# EAGLE design sa_dsp (EAGLE 9.6.2)
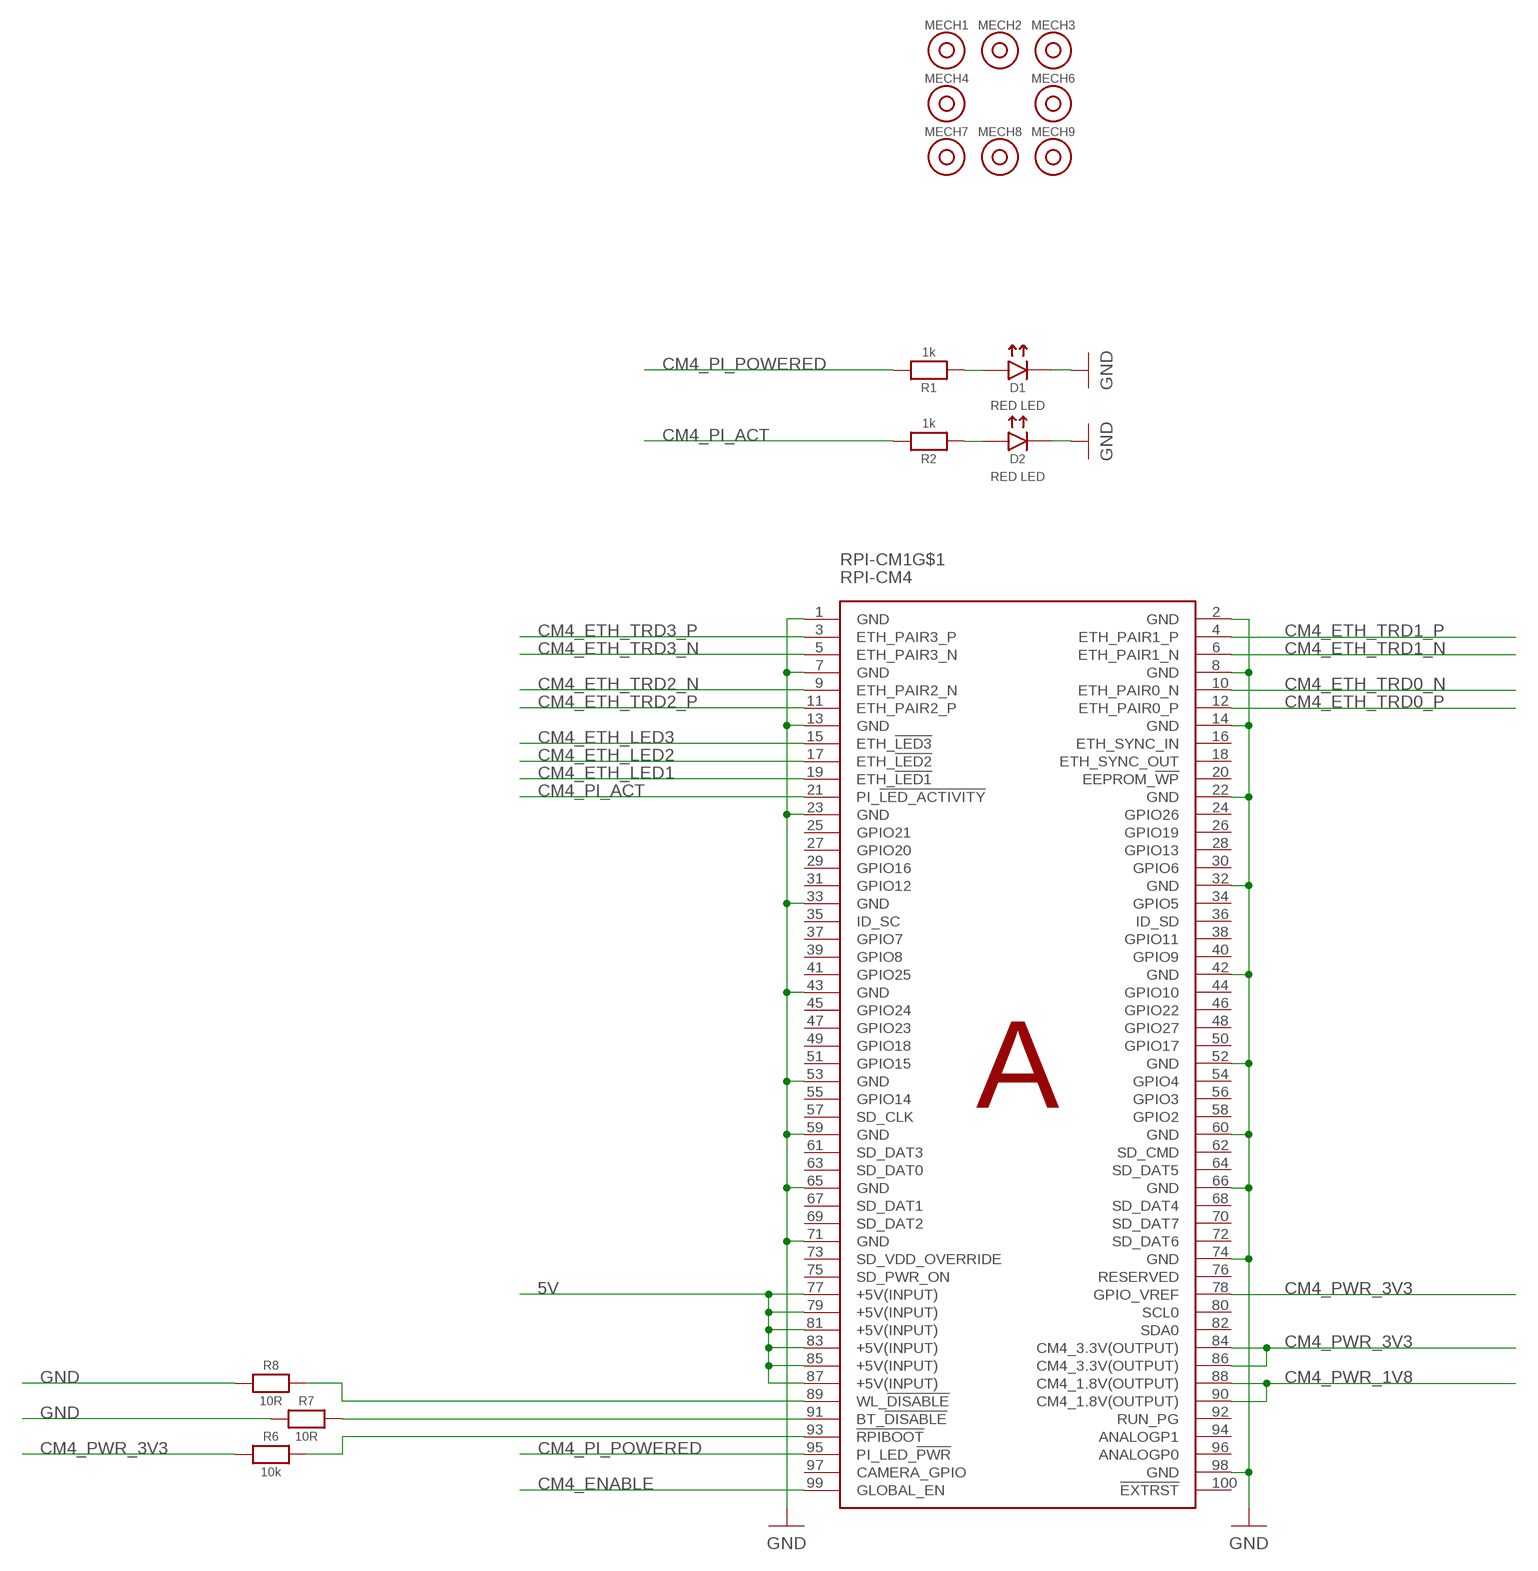
[diagram p0: schematic, sheet 1, part 1 of 2]
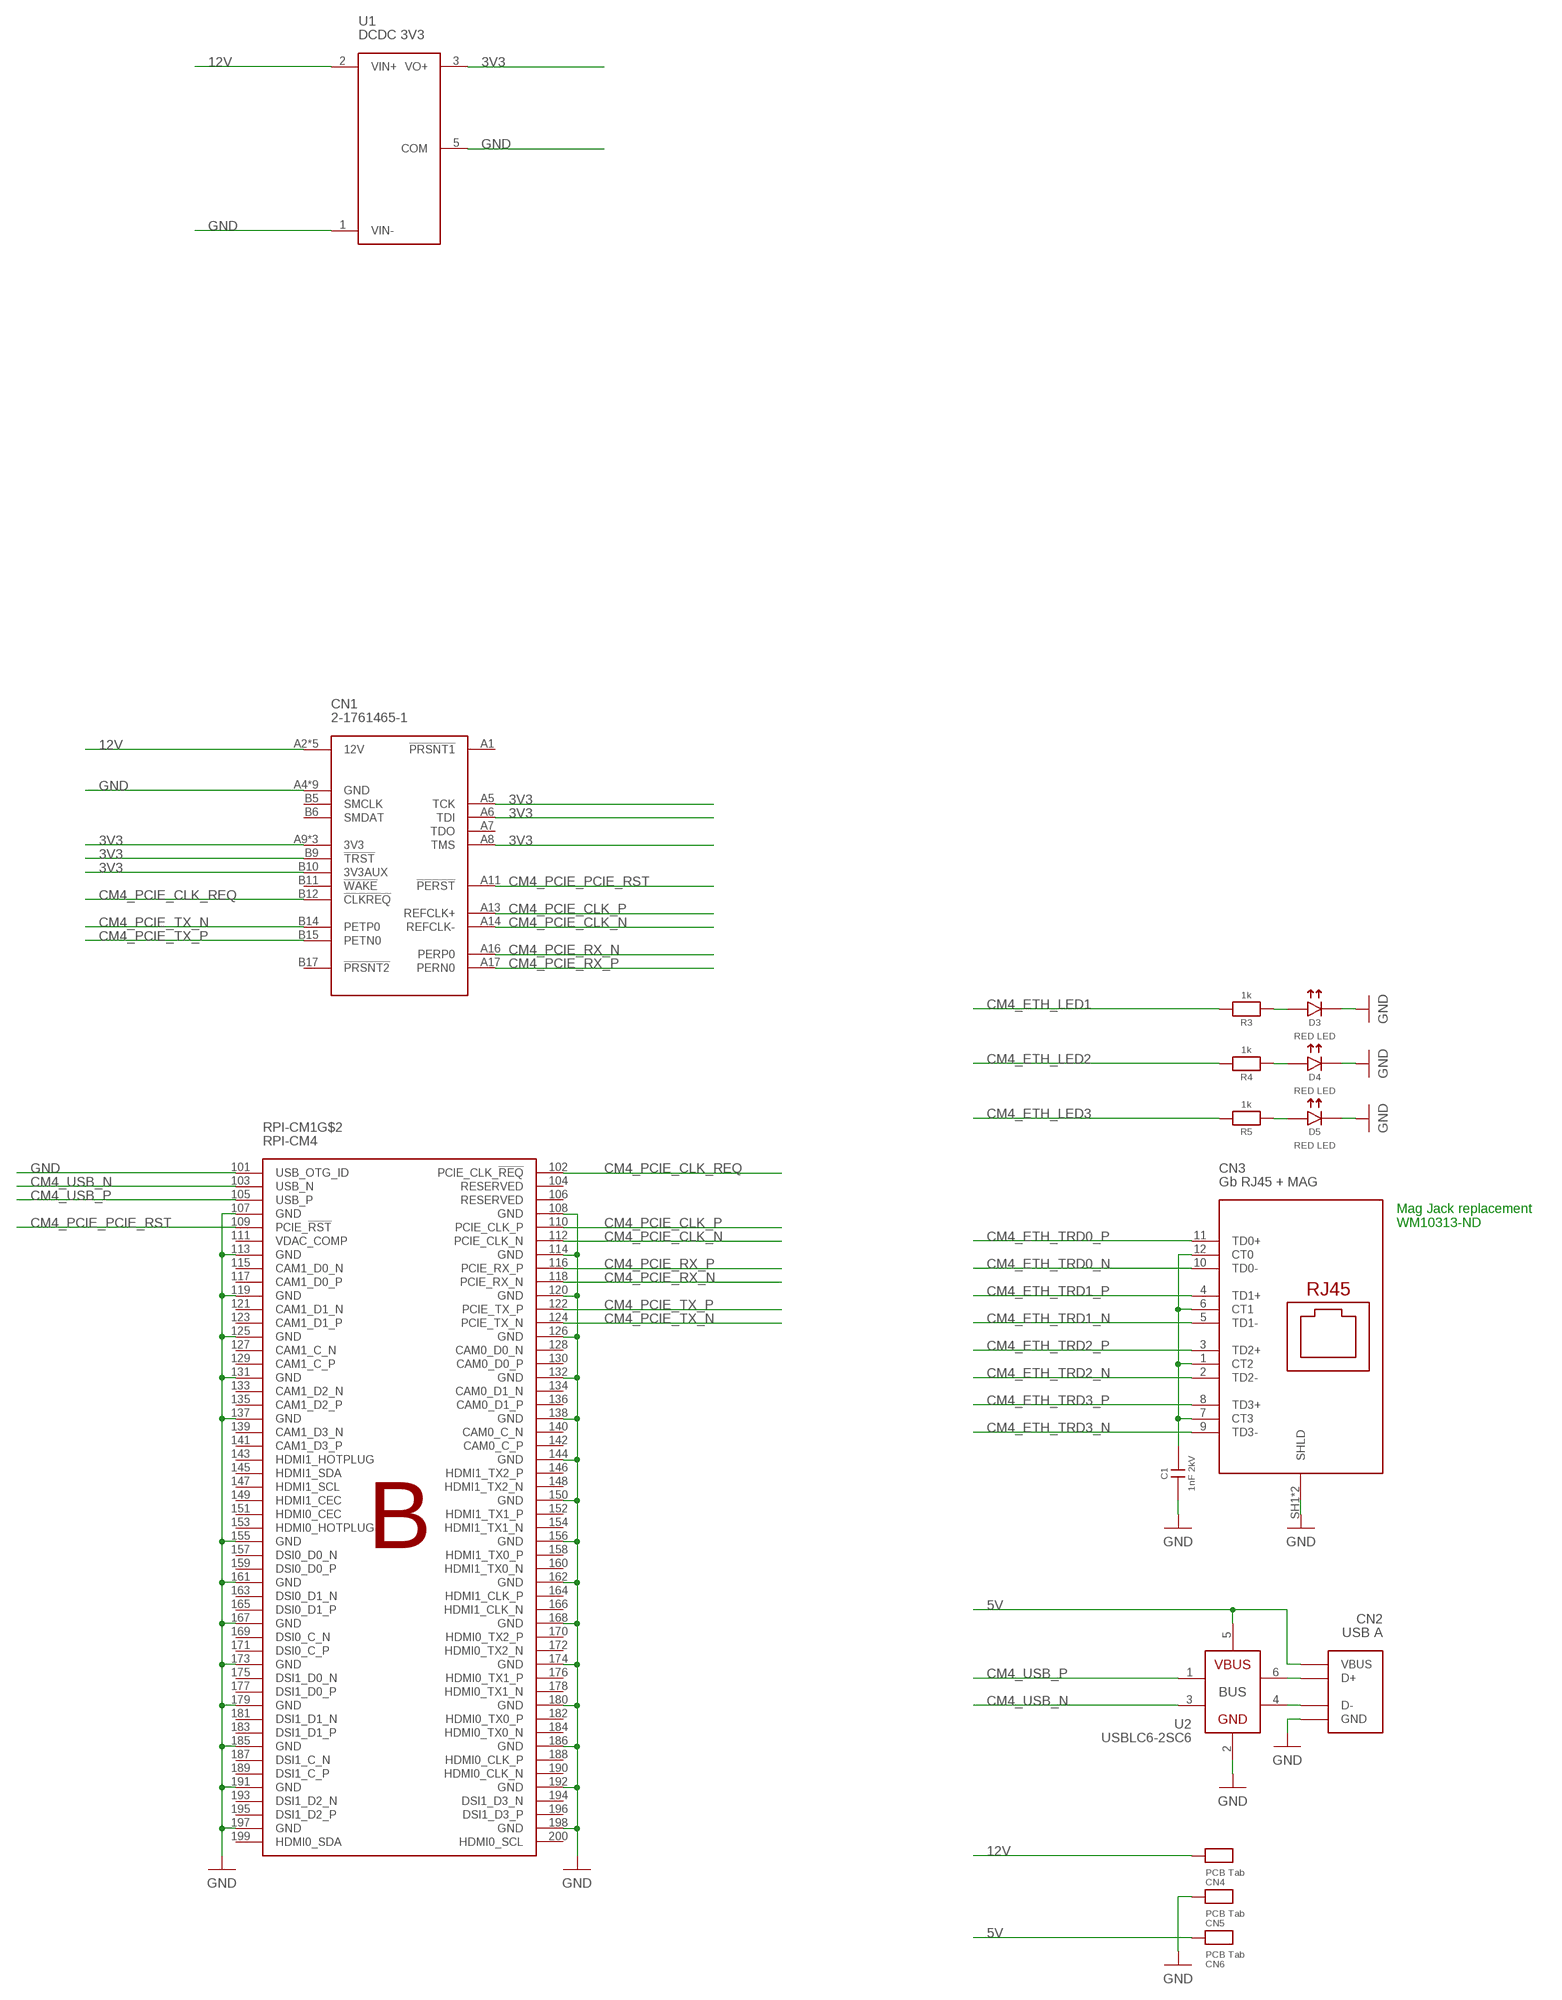
[diagram p1: schematic, sheet 1, part 2 of 2]

## Parts
C1  1nF 2kV  C1812C102KGRACAUTO  [1812]
CN1  2-1761465-1  [CONN36_2-1761465-1_TEC]
CN2  USB A  629104190121  [629104190121]
CN3  Gb RJ45 + MAG  0857931020  [0857931020]
CN4  PCB Tab  PCB_TAB_SMALL  [PCB_TAB_SMALL]
CN5  PCB Tab  PCB_TAB_SMALL  [PCB_TAB_SMALL]
CN6  PCB Tab  PCB_TAB_SMALL  [PCB_TAB_SMALL]
D1  RED LED  150060RS75000  [0603_POLAR]
D2  RED LED  150060RS75000  [0603_POLAR]
D3  RED LED  150060RS75000  [0603_POLAR]
D4  RED LED  150060RS75000  [0603_POLAR]
D5  RED LED  150060RS75000  [0603_POLAR]
MECH1  6mm x 3mm  MOUNTHOLE  [MOUNTHOLE_6X3]
MECH2  6mm x 3mm  MOUNTHOLE  [MOUNTHOLE_6X3]
MECH3  6mm x 3mm  MOUNTHOLE  [MOUNTHOLE_6X3]
MECH4  6mm x 3mm  MOUNTHOLE  [MOUNTHOLE_6X3]
MECH6  6mm x 3mm  MOUNTHOLE  [MOUNTHOLE_6X3]
MECH7  6mm x 3mm  MOUNTHOLE  [MOUNTHOLE_6X3]
MECH8  6mm x 3mm  MOUNTHOLE  [MOUNTHOLE_6X3]
MECH9  6mm x 3mm  MOUNTHOLE  [MOUNTHOLE_6X3]
R1  1k  CRCW06031K00FKEB  [0603]
R2  1k  CRCW06031K00FKEB  [0603]
R3  1k  CRCW06031K00FKEB  [0603]
R4  1k  CRCW06031K00FKEB  [0603]
R5  1k  CRCW06031K00FKEB  [0603]
R6  10k  CRCW060310K0FKTA  [0603]
R7  10R  CRCW060310R0FKTA  [0603]
R8  10R  CRCW060310R0FKTA  [0603]
RPI-CM1  RPI-CM4  [RPI-CM4]
U1  DCDC 3V3  PDQE15-Q24-S3-D  [PDQE10]
U2  USBLC6-2SC6  [SOT23-6]

## Nets
3V3: CN1.A5(TCK) CN1.A6(TDI) CN1.A8(TMS) CN1.A9(3V3) CN1.A10(3V3) CN1.B8(3V3) CN1.B9(!TRST) CN1.B10(3V3AUX) U1.3(VO+)
5V: CN2.1(VBUS) CN6.1 RPI-CM1.77(+5V(INPUT)) RPI-CM1.79(+5V(INPUT)) RPI-CM1.81(+5V(INPUT)) RPI-CM1.83(+5V(INPUT)) RPI-CM1.85(+5V(INPUT)) RPI-CM1.87(+5V(INPUT)) U2.5(VBUS)
12V: CN1.A2(12V) CN1.A3(12V) CN1.B1(12V) CN1.B2(12V) CN1.B3(12V) CN4.1 U1.2(VIN+)
CM4_ENABLE: RPI-CM1.99(GLOBAL_EN)
CM4_ETH_LED1: R3.2 RPI-CM1.19(ETH_!LED1)
CM4_ETH_LED2: R4.2 RPI-CM1.17(ETH_!LED2)
CM4_ETH_LED3: R5.2 RPI-CM1.15(ETH_!LED3)
CM4_ETH_TRD0_N: CN3.10(TD0-) RPI-CM1.10(ETH_PAIR0_N)
CM4_ETH_TRD0_P: CN3.11(TD0+) RPI-CM1.12(ETH_PAIR0_P)
CM4_ETH_TRD1_N: CN3.5(TD1-) RPI-CM1.6(ETH_PAIR1_N)
CM4_ETH_TRD1_P: CN3.4(TD1+) RPI-CM1.4(ETH_PAIR1_P)
CM4_ETH_TRD2_N: CN3.2(TD2-) RPI-CM1.9(ETH_PAIR2_N)
CM4_ETH_TRD2_P: CN3.3(TD2+) RPI-CM1.11(ETH_PAIR2_P)
CM4_ETH_TRD3_N: CN3.9(TD3-) RPI-CM1.5(ETH_PAIR3_N)
CM4_ETH_TRD3_P: CN3.8(TD3+) RPI-CM1.3(ETH_PAIR3_P)
CM4_PCIE_CLK_N: CN1.A14(REFCLK-) RPI-CM1.112(PCIE_CLK_N)
CM4_PCIE_CLK_P: CN1.A13(REFCLK+) RPI-CM1.110(PCIE_CLK_P)
CM4_PCIE_CLK_REQ: CN1.B12(!CLKREQ) RPI-CM1.102(PCIE_CLK_!REQ)
CM4_PCIE_PCIE_RST: CN1.A11(!PERST) RPI-CM1.109(PCIE_!RST)
CM4_PCIE_RX_N: CN1.A16(PERP0) RPI-CM1.118(PCIE_RX_N)
CM4_PCIE_RX_P: CN1.A17(PERN0) RPI-CM1.116(PCIE_RX_P)
CM4_PCIE_TX_N: CN1.B14(PETP0) RPI-CM1.124(PCIE_TX_N)
CM4_PCIE_TX_P: CN1.B15(PETN0) RPI-CM1.122(PCIE_TX_P)
CM4_PI_ACT: R2.2 RPI-CM1.21(PI_!LED_ACTIVITY)
CM4_PI_POWERED: R1.2 RPI-CM1.95(PI_LED_!PWR)
CM4_PWR_1V8: RPI-CM1.88(CM4_1.8V(OUTPUT)) RPI-CM1.90(CM4_1.8V(OUTPUT))
CM4_PWR_3V3: R6.1 RPI-CM1.78(GPIO_VREF) RPI-CM1.84(CM4_3.3V(OUTPUT)) RPI-CM1.86(CM4_3.3V(OUTPUT))
CM4_USB_N: RPI-CM1.103(USB_N) U2.3(D-_IN)
CM4_USB_P: RPI-CM1.105(USB_P) U2.1(D+_IN)
GND: C1.1 CN1.A4(GND) CN1.A12(GND) CN1.A15(GND) CN1.A18(GND) CN1.B4(GND) CN1.B7(GND) CN1.B13(GND) CN1.B16(GND) CN1.B18(GND) CN2.4(GND) CN2.SH1(GND) CN2.SH2(GND) CN2.SH3(GND) CN2.SH4(GND) CN3.SH1(SHLD) CN3.SH2(SHLD) CN5.1 D1.K D2.K D3.K D4.K D5.K R7.1 R8.1 RPI-CM1.1(GND) RPI-CM1.2(GND) RPI-CM1.7(GND) RPI-CM1.8(GND) RPI-CM1.13(GND) RPI-CM1.14(GND) RPI-CM1.22(GND) RPI-CM1.23(GND) RPI-CM1.32(GND) RPI-CM1.33(GND) RPI-CM1.42(GND) RPI-CM1.43(GND) RPI-CM1.52(GND) RPI-CM1.53(GND) RPI-CM1.59(GND) RPI-CM1.60(GND) RPI-CM1.65(GND) RPI-CM1.66(GND) RPI-CM1.71(GND) RPI-CM1.74(GND) RPI-CM1.98(GND) RPI-CM1.101(USB_OTG_ID) RPI-CM1.107(GND) RPI-CM1.108(GND) RPI-CM1.113(GND) RPI-CM1.114(GND) RPI-CM1.119(GND) RPI-CM1.120(GND) RPI-CM1.125(GND) RPI-CM1.126(GND) RPI-CM1.131(GND) RPI-CM1.132(GND) RPI-CM1.137(GND) RPI-CM1.138(GND) RPI-CM1.144(GND) RPI-CM1.150(GND) RPI-CM1.155(GND) RPI-CM1.156(GND) RPI-CM1.161(GND) RPI-CM1.162(GND) RPI-CM1.167(GND) RPI-CM1.168(GND) RPI-CM1.173(GND) RPI-CM1.174(GND) RPI-CM1.179(GND) RPI-CM1.180(GND) RPI-CM1.185(GND) RPI-CM1.186(GND) RPI-CM1.191(GND) RPI-CM1.192(GND) RPI-CM1.197(GND) RPI-CM1.198(GND) U1.1(VIN-) U1.5(COM) U2.2(GND)
N$1: D1.A R1.1
N$2: CN2.2(D-) U2.4(D-OUT)
N$3: D2.A R2.1
N$4: CN2.3(D+) U2.6(D+_OUT)
N$5: D3.A R3.1
N$6: C1.2 CN3.1(CT2) CN3.6(CT1) CN3.7(CT3) CN3.12(CT0)
N$7: D4.A R4.1
N$8: R6.2 RPI-CM1.93(!RPIBOOT)
N$9: D5.A R5.1
N$10: R7.2 RPI-CM1.91(BT_!DISABLE)
N$11: R8.2 RPI-CM1.89(WL_!DISABLE)
Unconnected: CN1.A1(!PRSNT1) CN1.A7(TDO) CN1.B5(SMCLK) CN1.B6(SMDAT) CN1.B11(!WAKE) CN1.B17(!PRSNT2) RPI-CM1.16(ETH_SYNC_IN) RPI-CM1.18(ETH_SYNC_OUT) RPI-CM1.20(EEPROM_!WP) RPI-CM1.24(GPIO26) RPI-CM1.25(GPIO21) RPI-CM1.26(GPIO19) RPI-CM1.27(GPIO20) RPI-CM1.28(GPIO13) RPI-CM1.29(GPIO16) RPI-CM1.30(GPIO6) RPI-CM1.31(GPIO12) RPI-CM1.34(GPIO5) RPI-CM1.35(ID_SC) RPI-CM1.36(ID_SD) RPI-CM1.37(GPIO7) RPI-CM1.38(GPIO11) RPI-CM1.39(GPIO8) RPI-CM1.40(GPIO9) RPI-CM1.41(GPIO25) RPI-CM1.44(GPIO10) RPI-CM1.45(GPIO24) RPI-CM1.46(GPIO22) RPI-CM1.47(GPIO23) RPI-CM1.48(GPIO27) RPI-CM1.49(GPIO18) RPI-CM1.50(GPIO17) RPI-CM1.51(GPIO15) RPI-CM1.54(GPIO4) RPI-CM1.55(GPIO14) RPI-CM1.56(GPIO3) RPI-CM1.57(SD_CLK) RPI-CM1.58(GPIO2) RPI-CM1.61(SD_DAT3) RPI-CM1.62(SD_CMD) RPI-CM1.63(SD_DAT0) RPI-CM1.64(SD_DAT5) RPI-CM1.67(SD_DAT1) RPI-CM1.68(SD_DAT4) RPI-CM1.69(SD_DAT2) RPI-CM1.70(SD_DAT7) RPI-CM1.72(SD_DAT6) RPI-CM1.73(SD_VDD_OVERRIDE) RPI-CM1.75(SD_PWR_ON) RPI-CM1.76(RESERVED) RPI-CM1.80(SCL0) RPI-CM1.82(SDA0) RPI-CM1.92(RUN_PG) RPI-CM1.94(ANALOGP1) RPI-CM1.96(ANALOGP0) RPI-CM1.97(CAMERA_GPIO) RPI-CM1.100(!EXTRST) RPI-CM1.104(RESERVED) RPI-CM1.106(RESERVED) RPI-CM1.111(VDAC_COMP) RPI-CM1.115(CAM1_D0_N) RPI-CM1.117(CAM1_D0_P) RPI-CM1.121(CAM1_D1_N) RPI-CM1.123(CAM1_D1_P) RPI-CM1.127(CAM1_C_N) RPI-CM1.128(CAM0_D0_N) RPI-CM1.129(CAM1_C_P) RPI-CM1.130(CAM0_D0_P) RPI-CM1.133(CAM1_D2_N) RPI-CM1.134(CAM0_D1_N) RPI-CM1.135(CAM1_D2_P) RPI-CM1.136(CAM0_D1_P) RPI-CM1.139(CAM1_D3_N) RPI-CM1.140(CAM0_C_N) RPI-CM1.141(CAM1_D3_P) RPI-CM1.142(CAM0_C_P) RPI-CM1.143(HDMI1_HOTPLUG) RPI-CM1.145(HDMI1_SDA) RPI-CM1.146(HDMI1_TX2_P) RPI-CM1.147(HDMI1_SCL) RPI-CM1.148(HDMI1_TX2_N) RPI-CM1.149(HDMI1_CEC) RPI-CM1.151(HDMI0_CEC) RPI-CM1.152(HDMI1_TX1_P) RPI-CM1.153(HDMI0_HOTPLUG) RPI-CM1.154(HDMI1_TX1_N) RPI-CM1.157(DSI0_D0_N) RPI-CM1.158(HDMI1_TX0_P) RPI-CM1.159(DSI0_D0_P) RPI-CM1.160(HDMI1_TX0_N) RPI-CM1.163(DSI0_D1_N) RPI-CM1.164(HDMI1_CLK_P) RPI-CM1.165(DSI0_D1_P) RPI-CM1.166(HDMI1_CLK_N) RPI-CM1.169(DSI0_C_N) RPI-CM1.170(HDMI0_TX2_P) RPI-CM1.171(DSI0_C_P) RPI-CM1.172(HDMI0_TX2_N) RPI-CM1.175(DSI1_D0_N) RPI-CM1.176(HDMI0_TX1_P) RPI-CM1.177(DSI1_D0_P) RPI-CM1.178(HDMI0_TX1_N) RPI-CM1.181(DSI1_D1_N) RPI-CM1.182(HDMI0_TX0_P) RPI-CM1.183(DSI1_D1_P) RPI-CM1.184(HDMI0_TX0_N) RPI-CM1.187(DSI1_C_N) RPI-CM1.188(HDMI0_CLK_P) RPI-CM1.189(DSI1_C_P) RPI-CM1.190(HDMI0_CLK_N) RPI-CM1.193(DSI1_D2_N) RPI-CM1.194(DSI1_D3_N) RPI-CM1.195(DSI1_D2_P) RPI-CM1.196(DSI1_D3_P) RPI-CM1.199(HDMI0_SDA) RPI-CM1.200(HDMI0_SCL)

## Notes on the sheet
- Mag Jack replacement
  WM10313-ND

## Library data of the parts
C1 = CAPACITORS:C1812C102KGRACAUTO: 1nF 2000V X7R 10% 1812 MLCC.; DIGIKEY: 399-16774-1-ND; HEIGHT: 1.6; PRICE_PER: 0.32
CN1 = CONNECTORs:2-1761465-1: 36 Position Female Connector PCI Express™ Gold 0.039" (1.00mm) Black; DIGIKEY: A118393-ND; HEIGHT: 9.4; PRICE_PER: 6.58
CN2 = CONNECTORs:629104190121: USB - A USB 2.0 Receptacle Connector 4 Position Surface Mount, Right Angle; DIGIKEY: 732-11179-1-ND; HEIGHT: 6.3; PRICE_PER: 1.15
CN3 = CONNECTORs:0857931020: 1 Port RJ45 Magjack Connector Through Hole 10/100/1000 Base-T, AutoMDIX; DIGIKEY: WM10314-ND; HEIGHT: 15.05; PRICE_PER: 4.22
CN4-CN6 = CONNECTORs:PCB_TAB_SMALL: PCB tab for soldering. Built into the PCB.; HEIGHT: 2; PRICE_PER: 0
D1-D5 = OPTO:150060RS75000: Red 625nm LED Indication - Discrete 2V 0603 (1608 Metric); DIGIKEY: 732-4978-1-ND; HEIGHT: 1; PRICE_PER: 0.11
MECH1-MECH4 MECH6-MECH9 = MISC:MOUNTHOLE: Mechanical mounting hole.
R1-R5 = r_0603:CRCW06031K00FKEB: 1000 ±1% 1k Thick Film 0.1W, 1/10W 0603; DIGIKEY: 541-2985-1-ND; HEIGHT: 1; MANUFACTURER: Vishay Dale; POWER: 0.1W, 1/10W; PRICE_PER: 0.07000; STOCK: 1537; TOLERANCE: ±1%
R6 = r_0603:CRCW060310K0FKTA: 10000 ±1% 10k Thick Film 0.1W, 1/10W 0603; DIGIKEY: 541-2980-1-ND; HEIGHT: 1; MANUFACTURER: Vishay Dale; POWER: 0.1W, 1/10W; PRICE_PER: 0.12000; STOCK: 50797; TOLERANCE: ±1%
R7 R8 = r_0603:CRCW060310R0FKTA: 10 ±1% 10 Ohms Thick Film 0.1W, 1/10W 0603; DIGIKEY: 541-2983-1-ND; HEIGHT: 1; MANUFACTURER: Vishay Dale; POWER: 0.1W, 1/10W; PRICE_PER: 0.12000; STOCK: 19024; TOLERANCE: ±1%
RPI-CM1 = RPI-CM4:RPI-CM4
U1 = ICs:PDQE15-Q24-S3-D: Isolated Module DC DC Converter 1 Output 3.3V 4A 9V - 36V Input; DIGIKEY: 102-6252-ND; HEIGHT: 12; PRICE_PER: 14.88
U2 = ICs:USBLC6-2SC6: Very low capacitance ESD protection; DIGIKEY: 497-11882-1-ND; HEIGHT: 1.5; PRICE_PER: 0.38

## Board
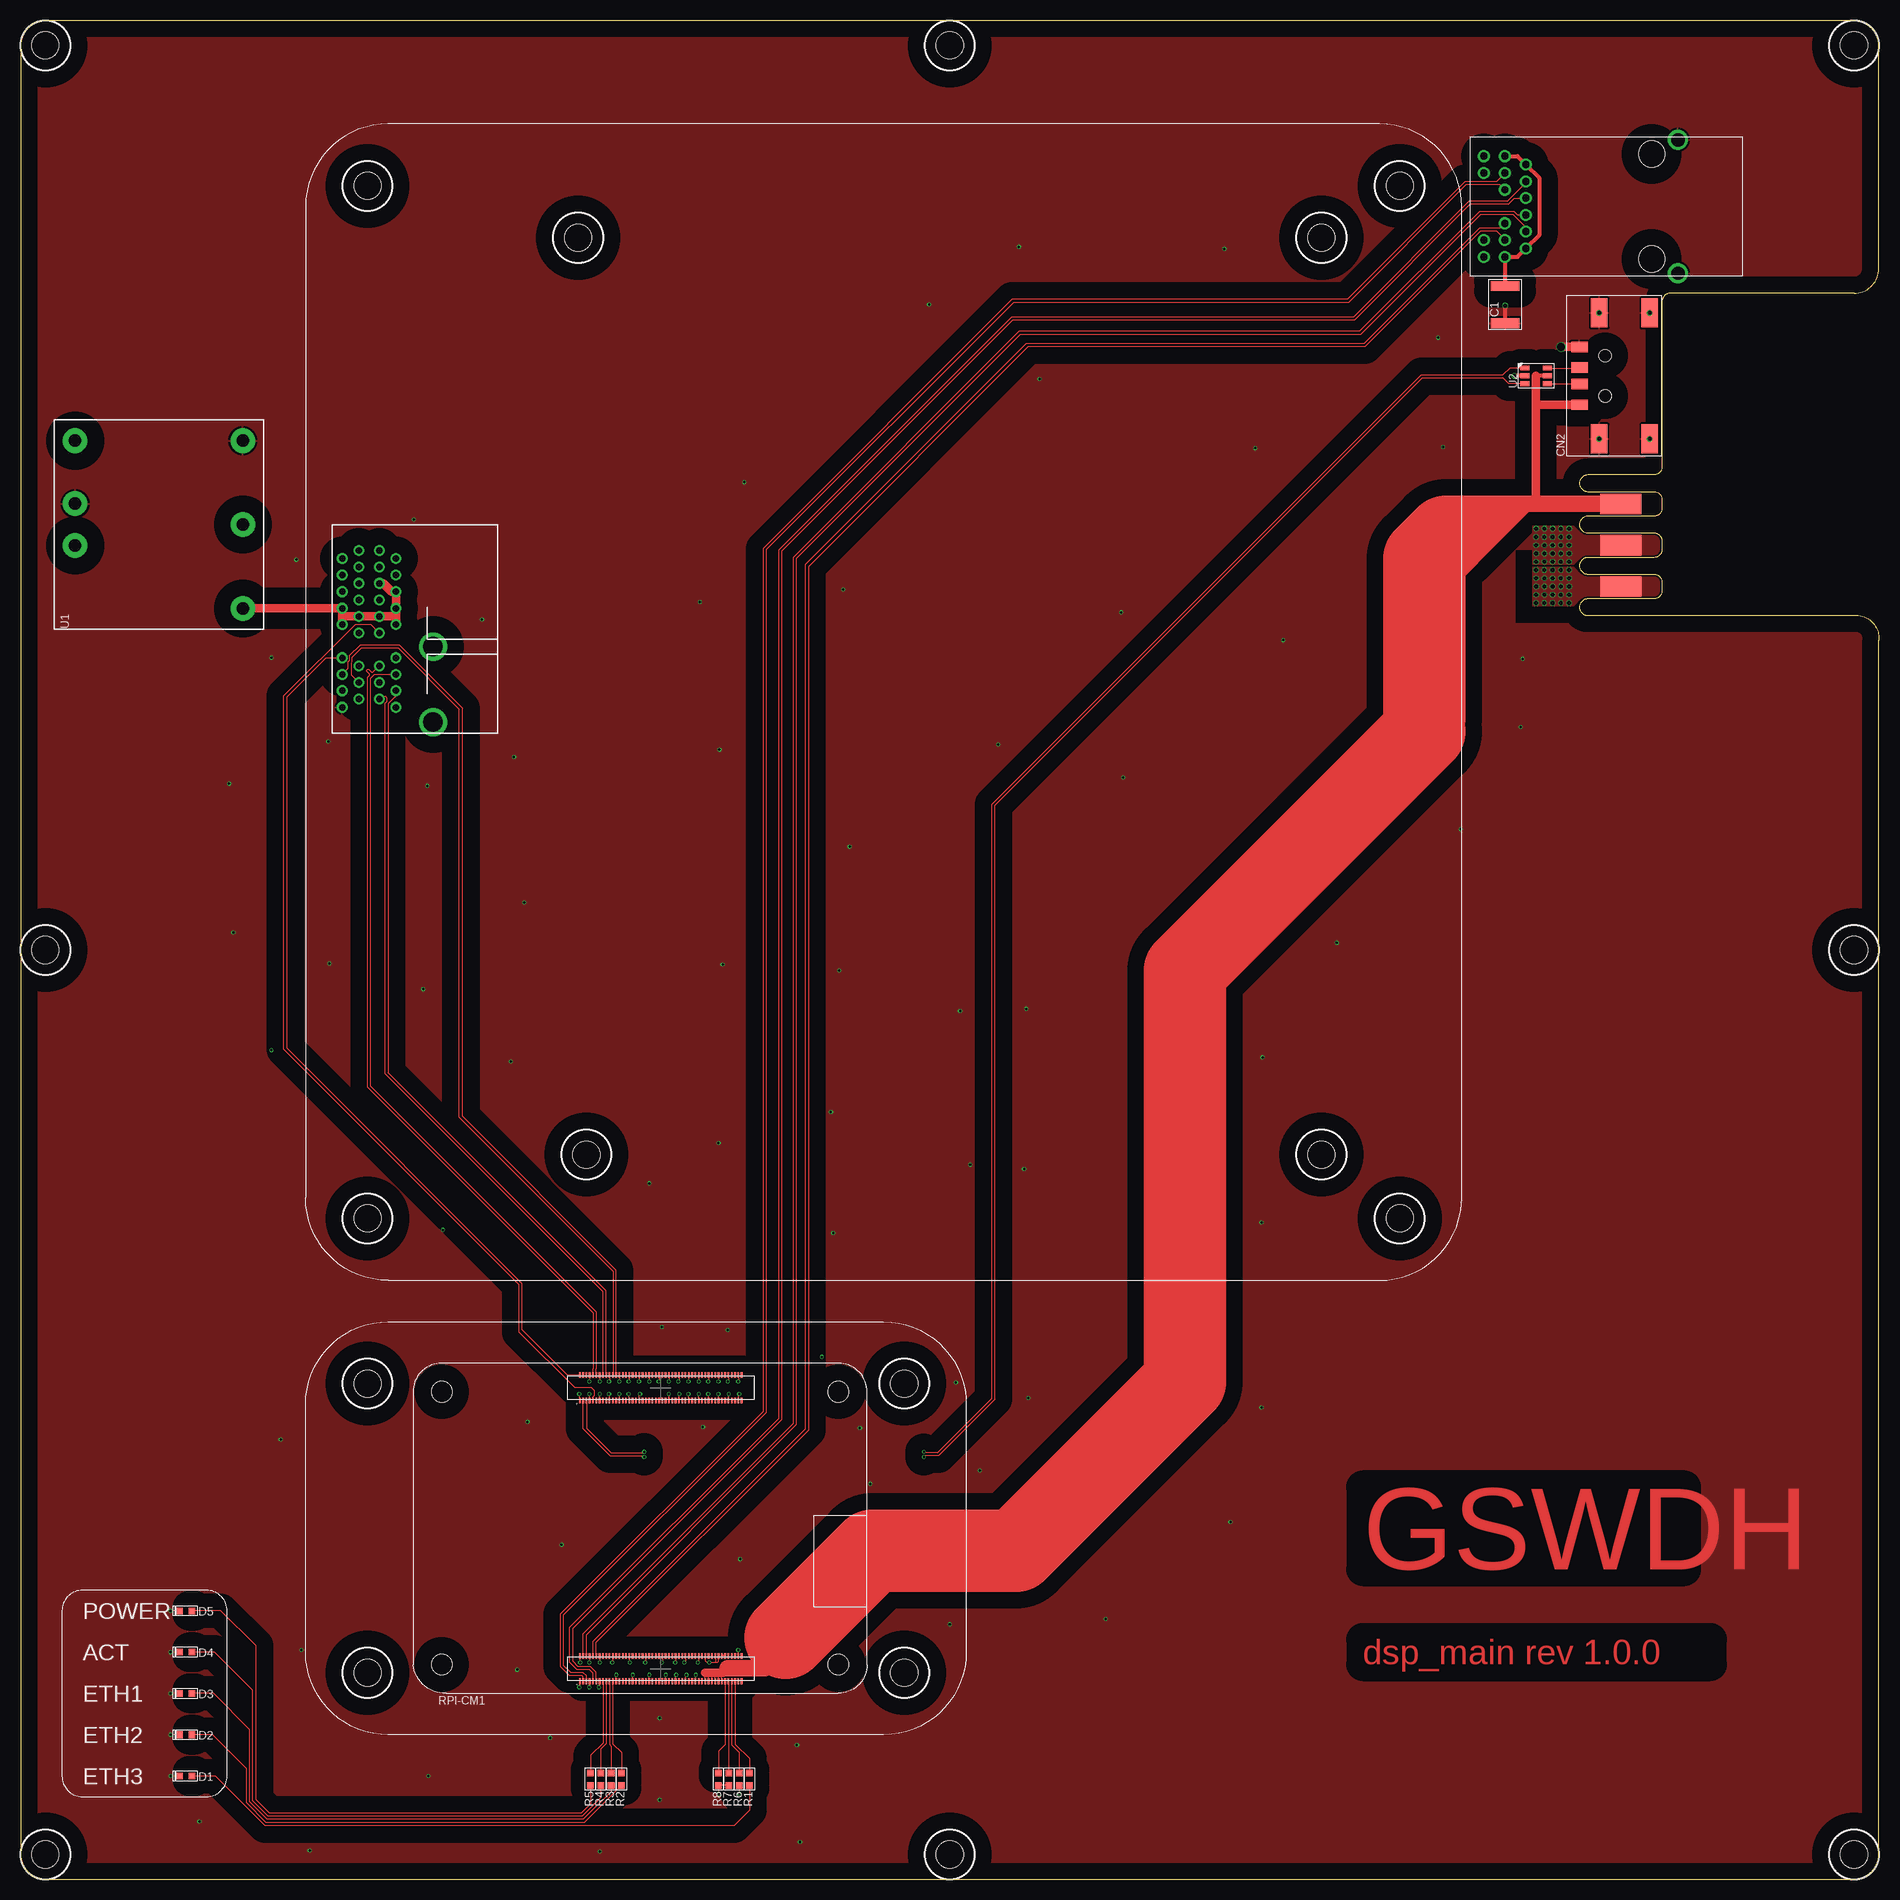
[diagram p2: board, top side]
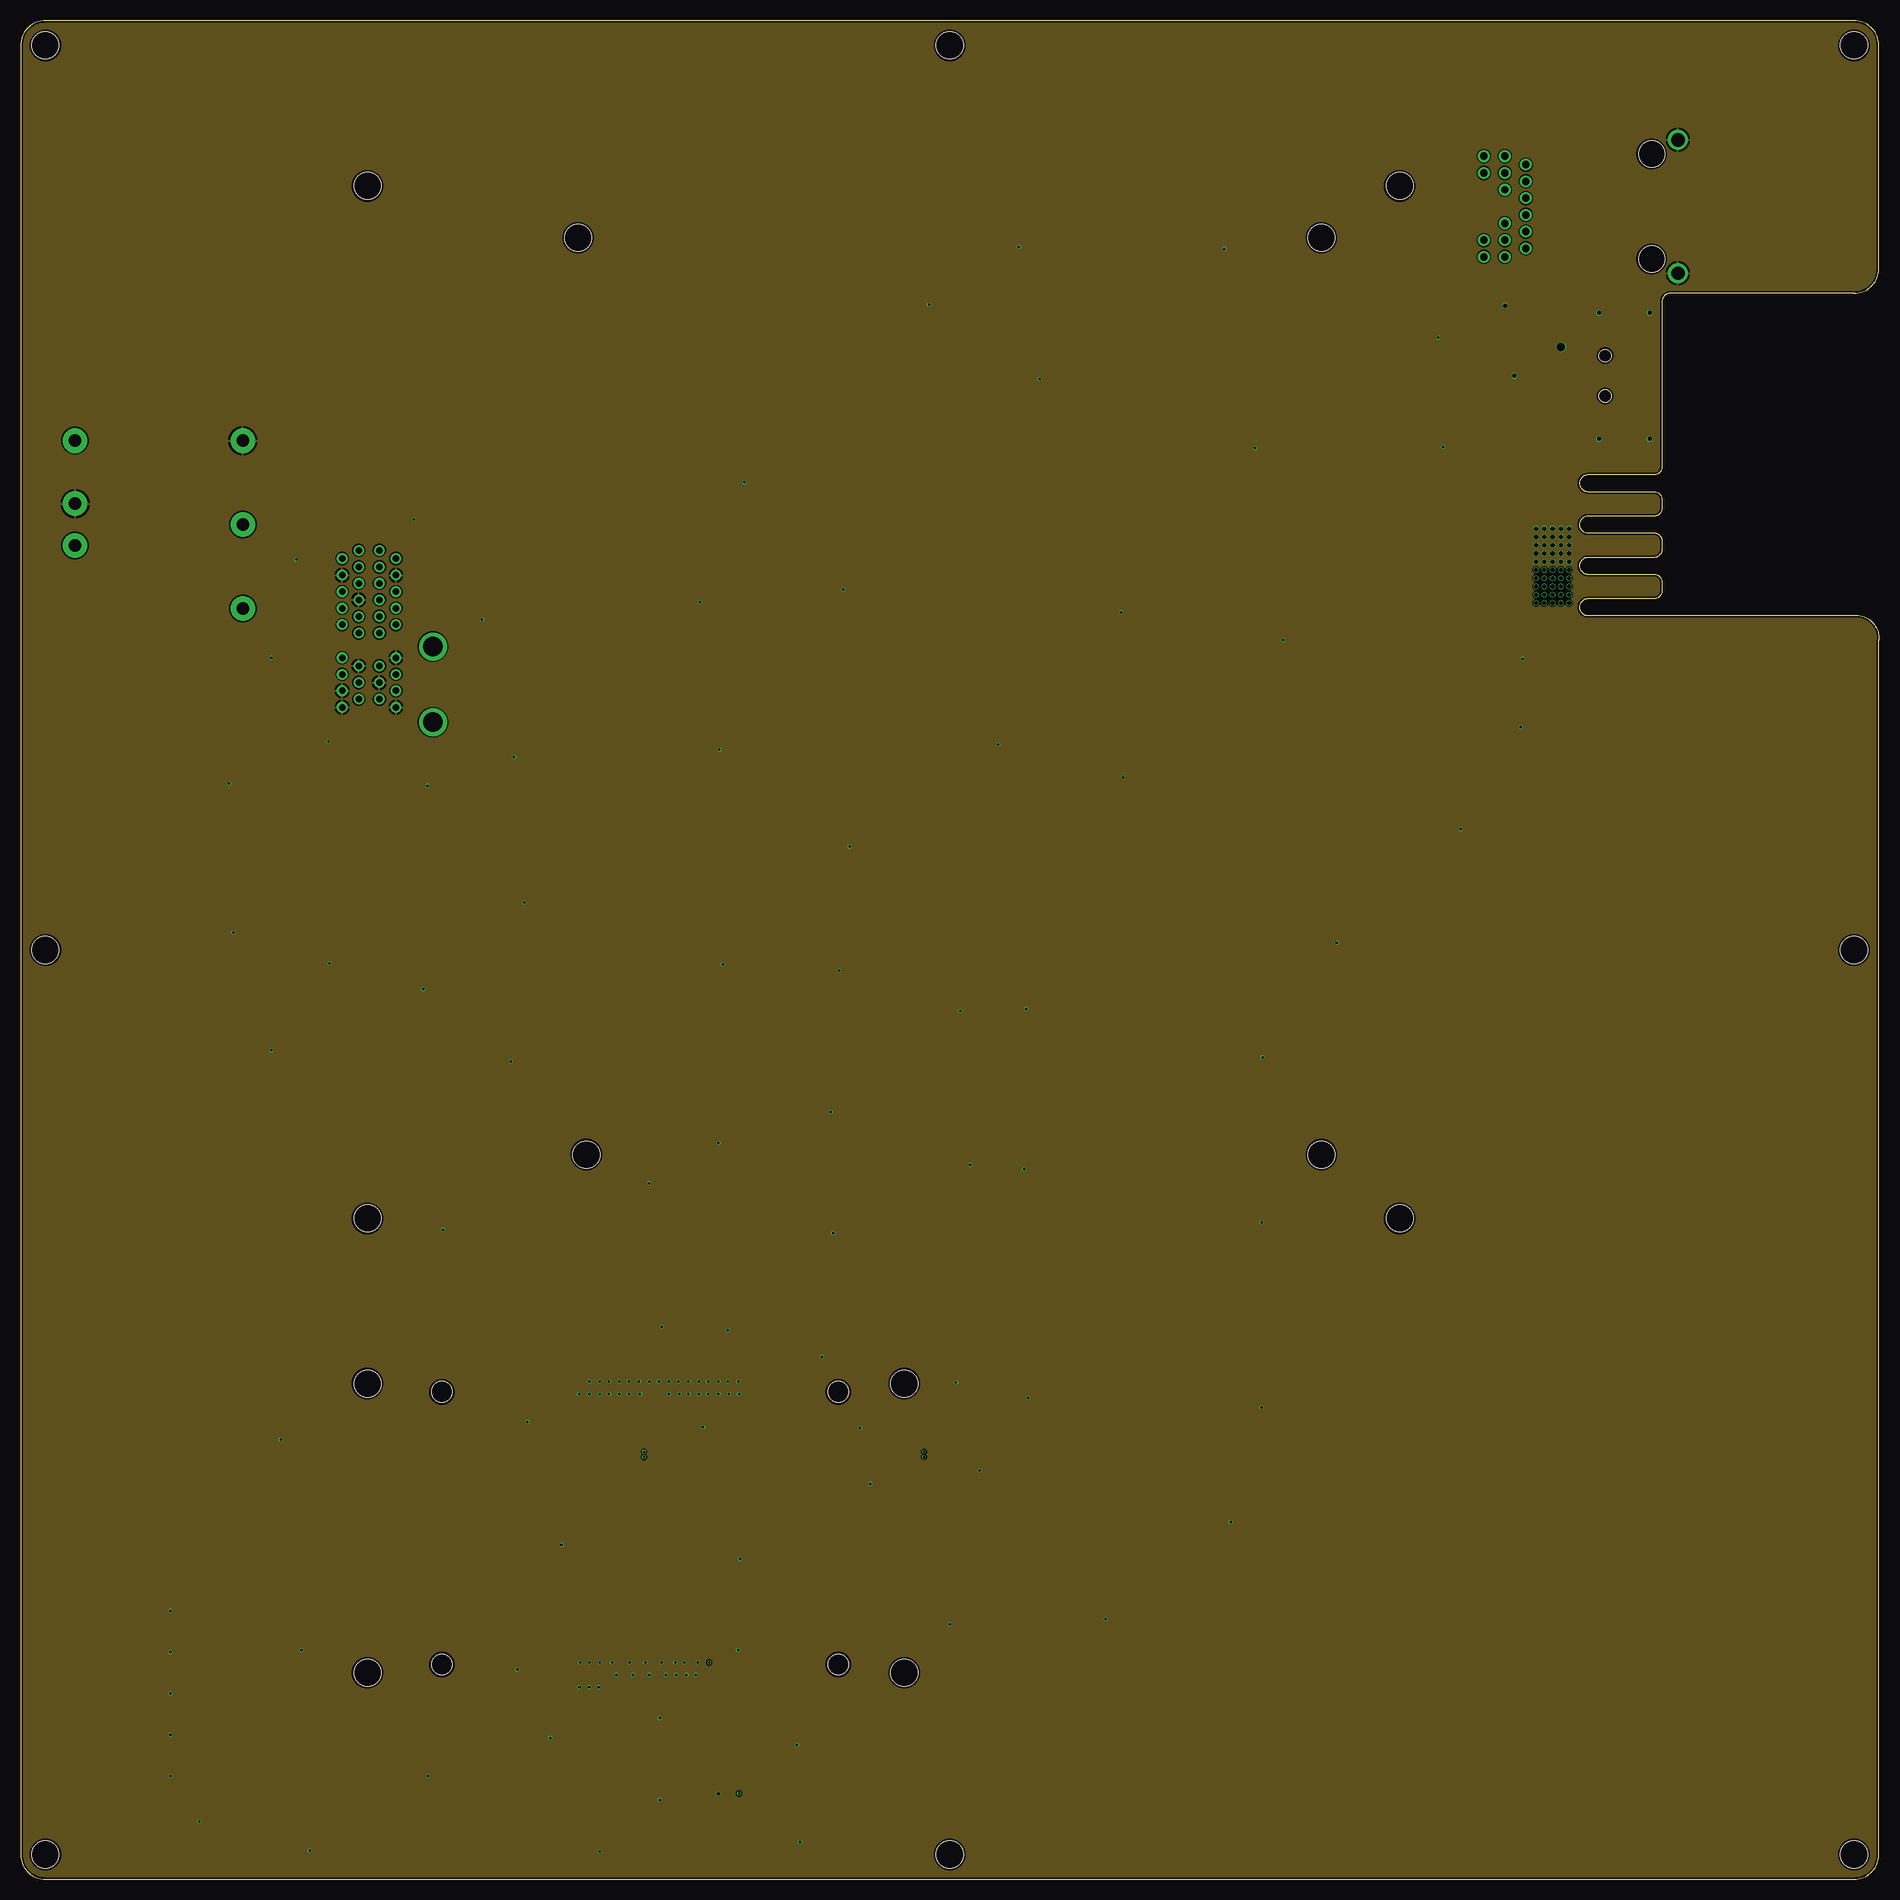
[diagram p3: board, inner layer GND]
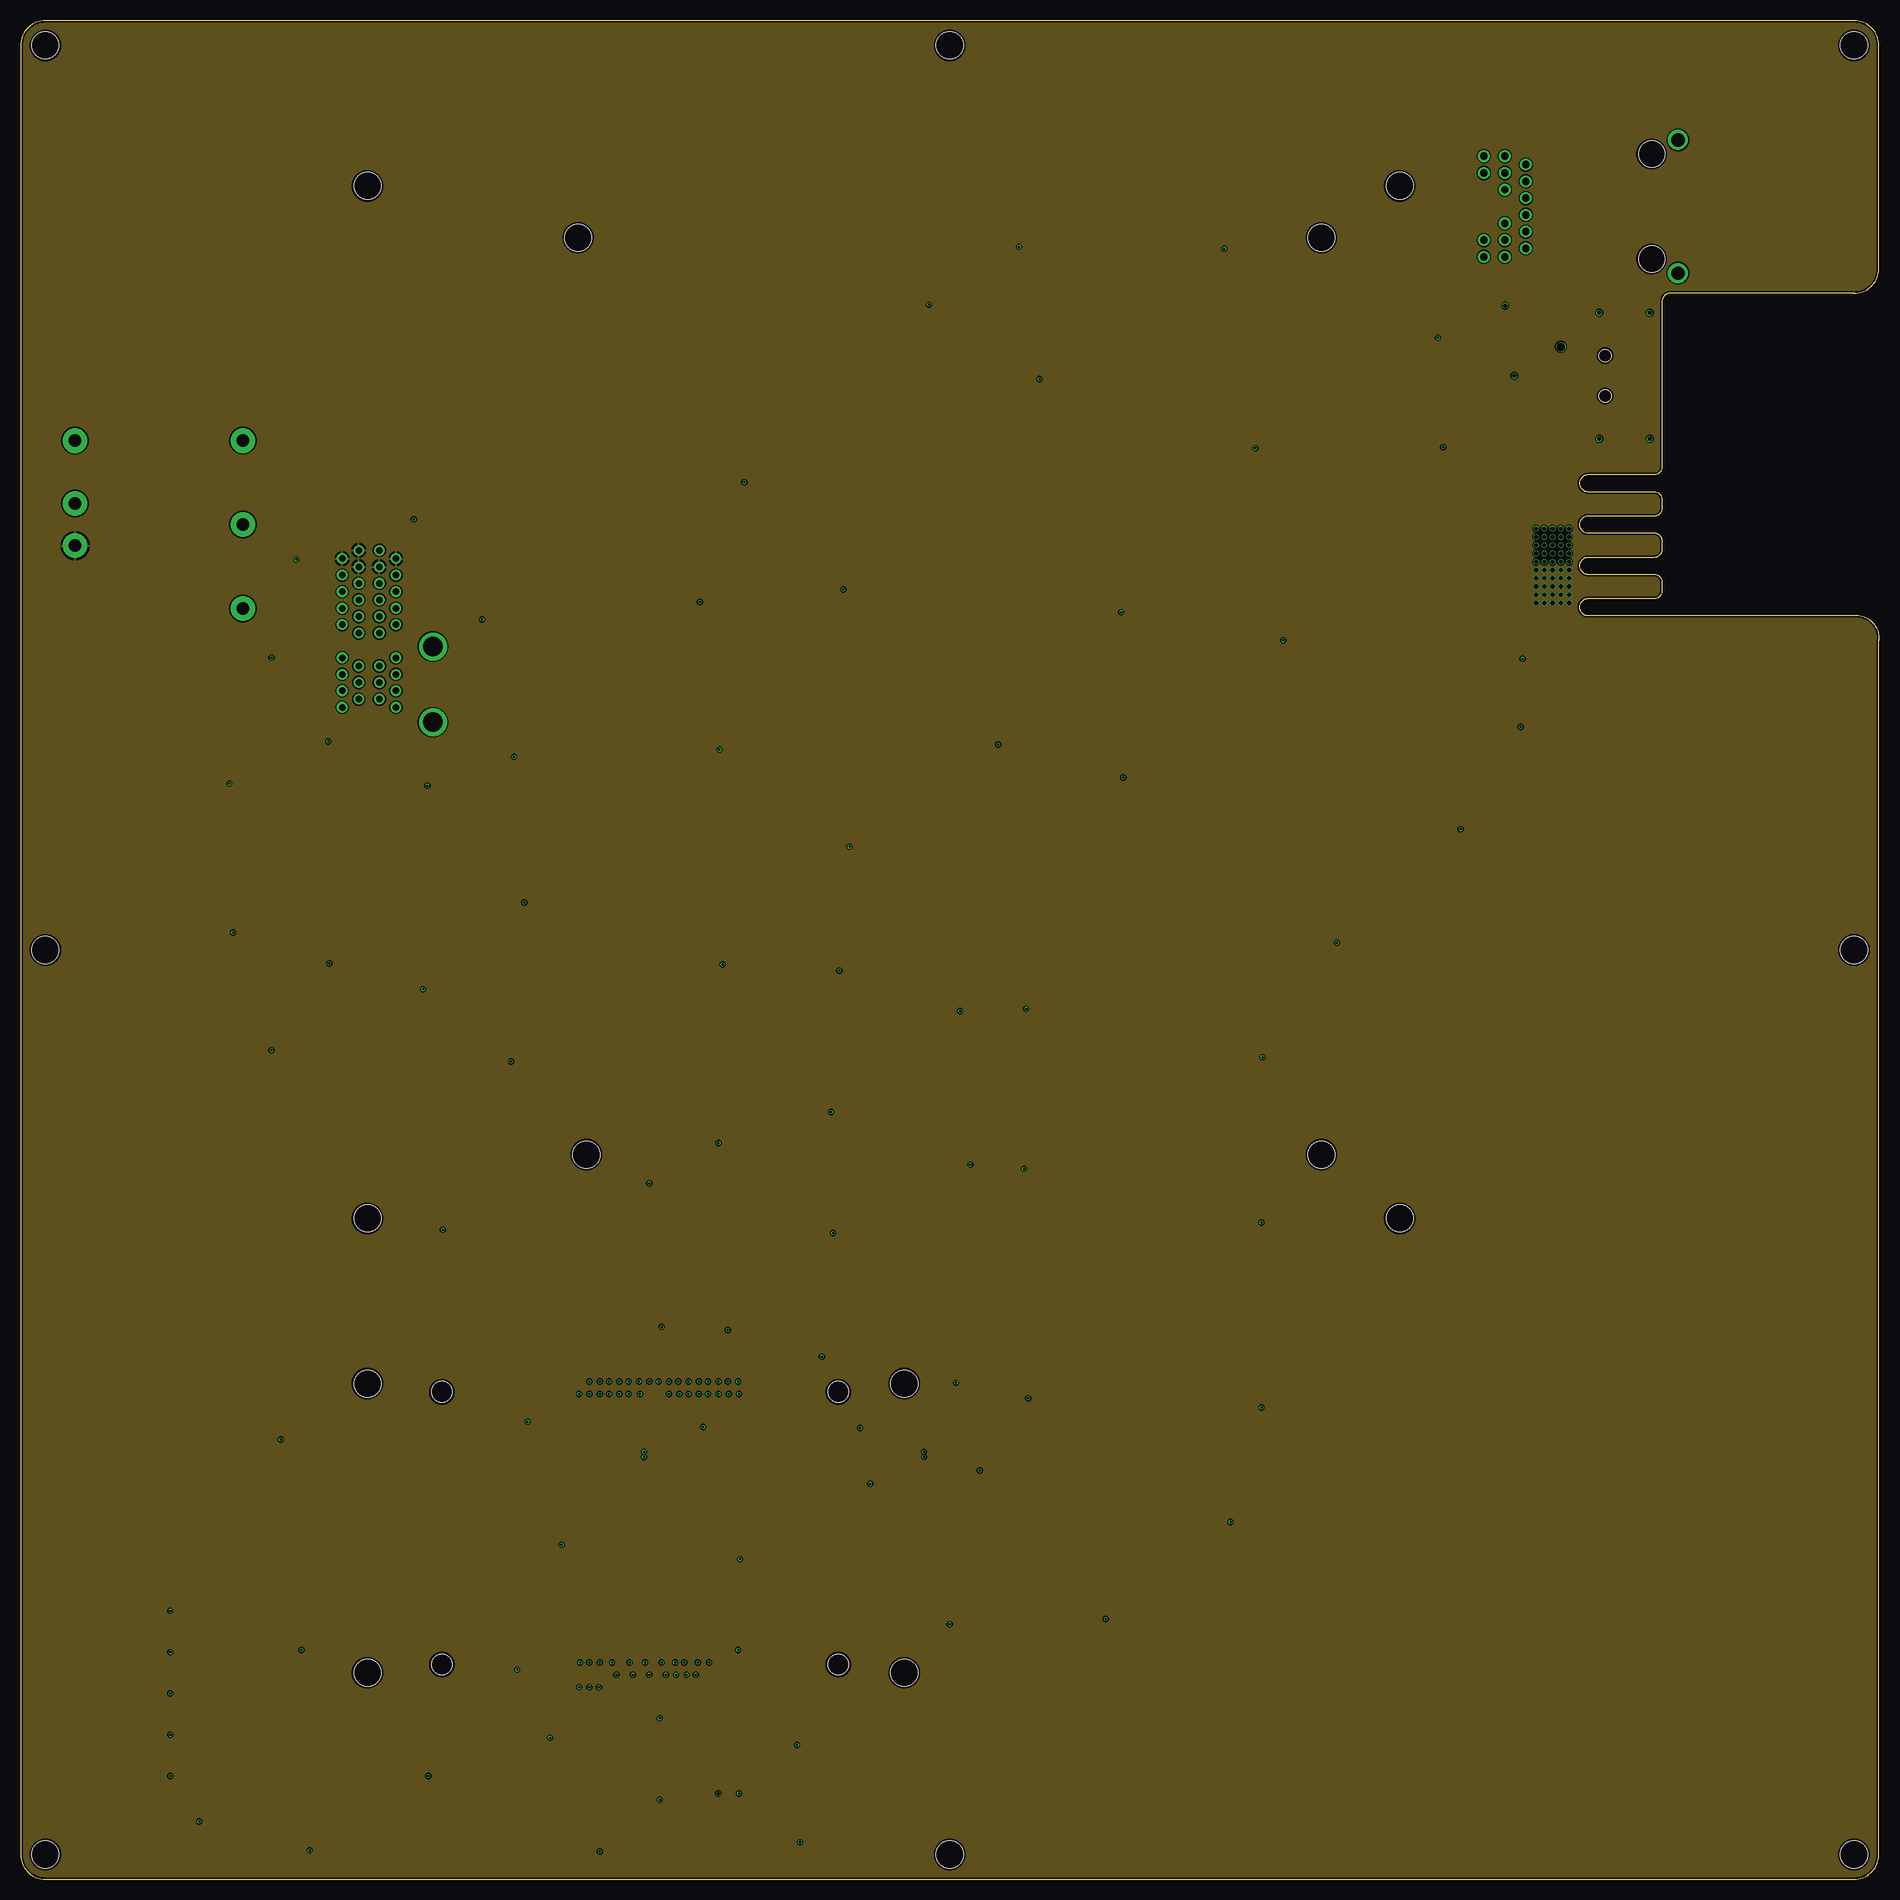
[diagram p4: board, inner layer PWR]
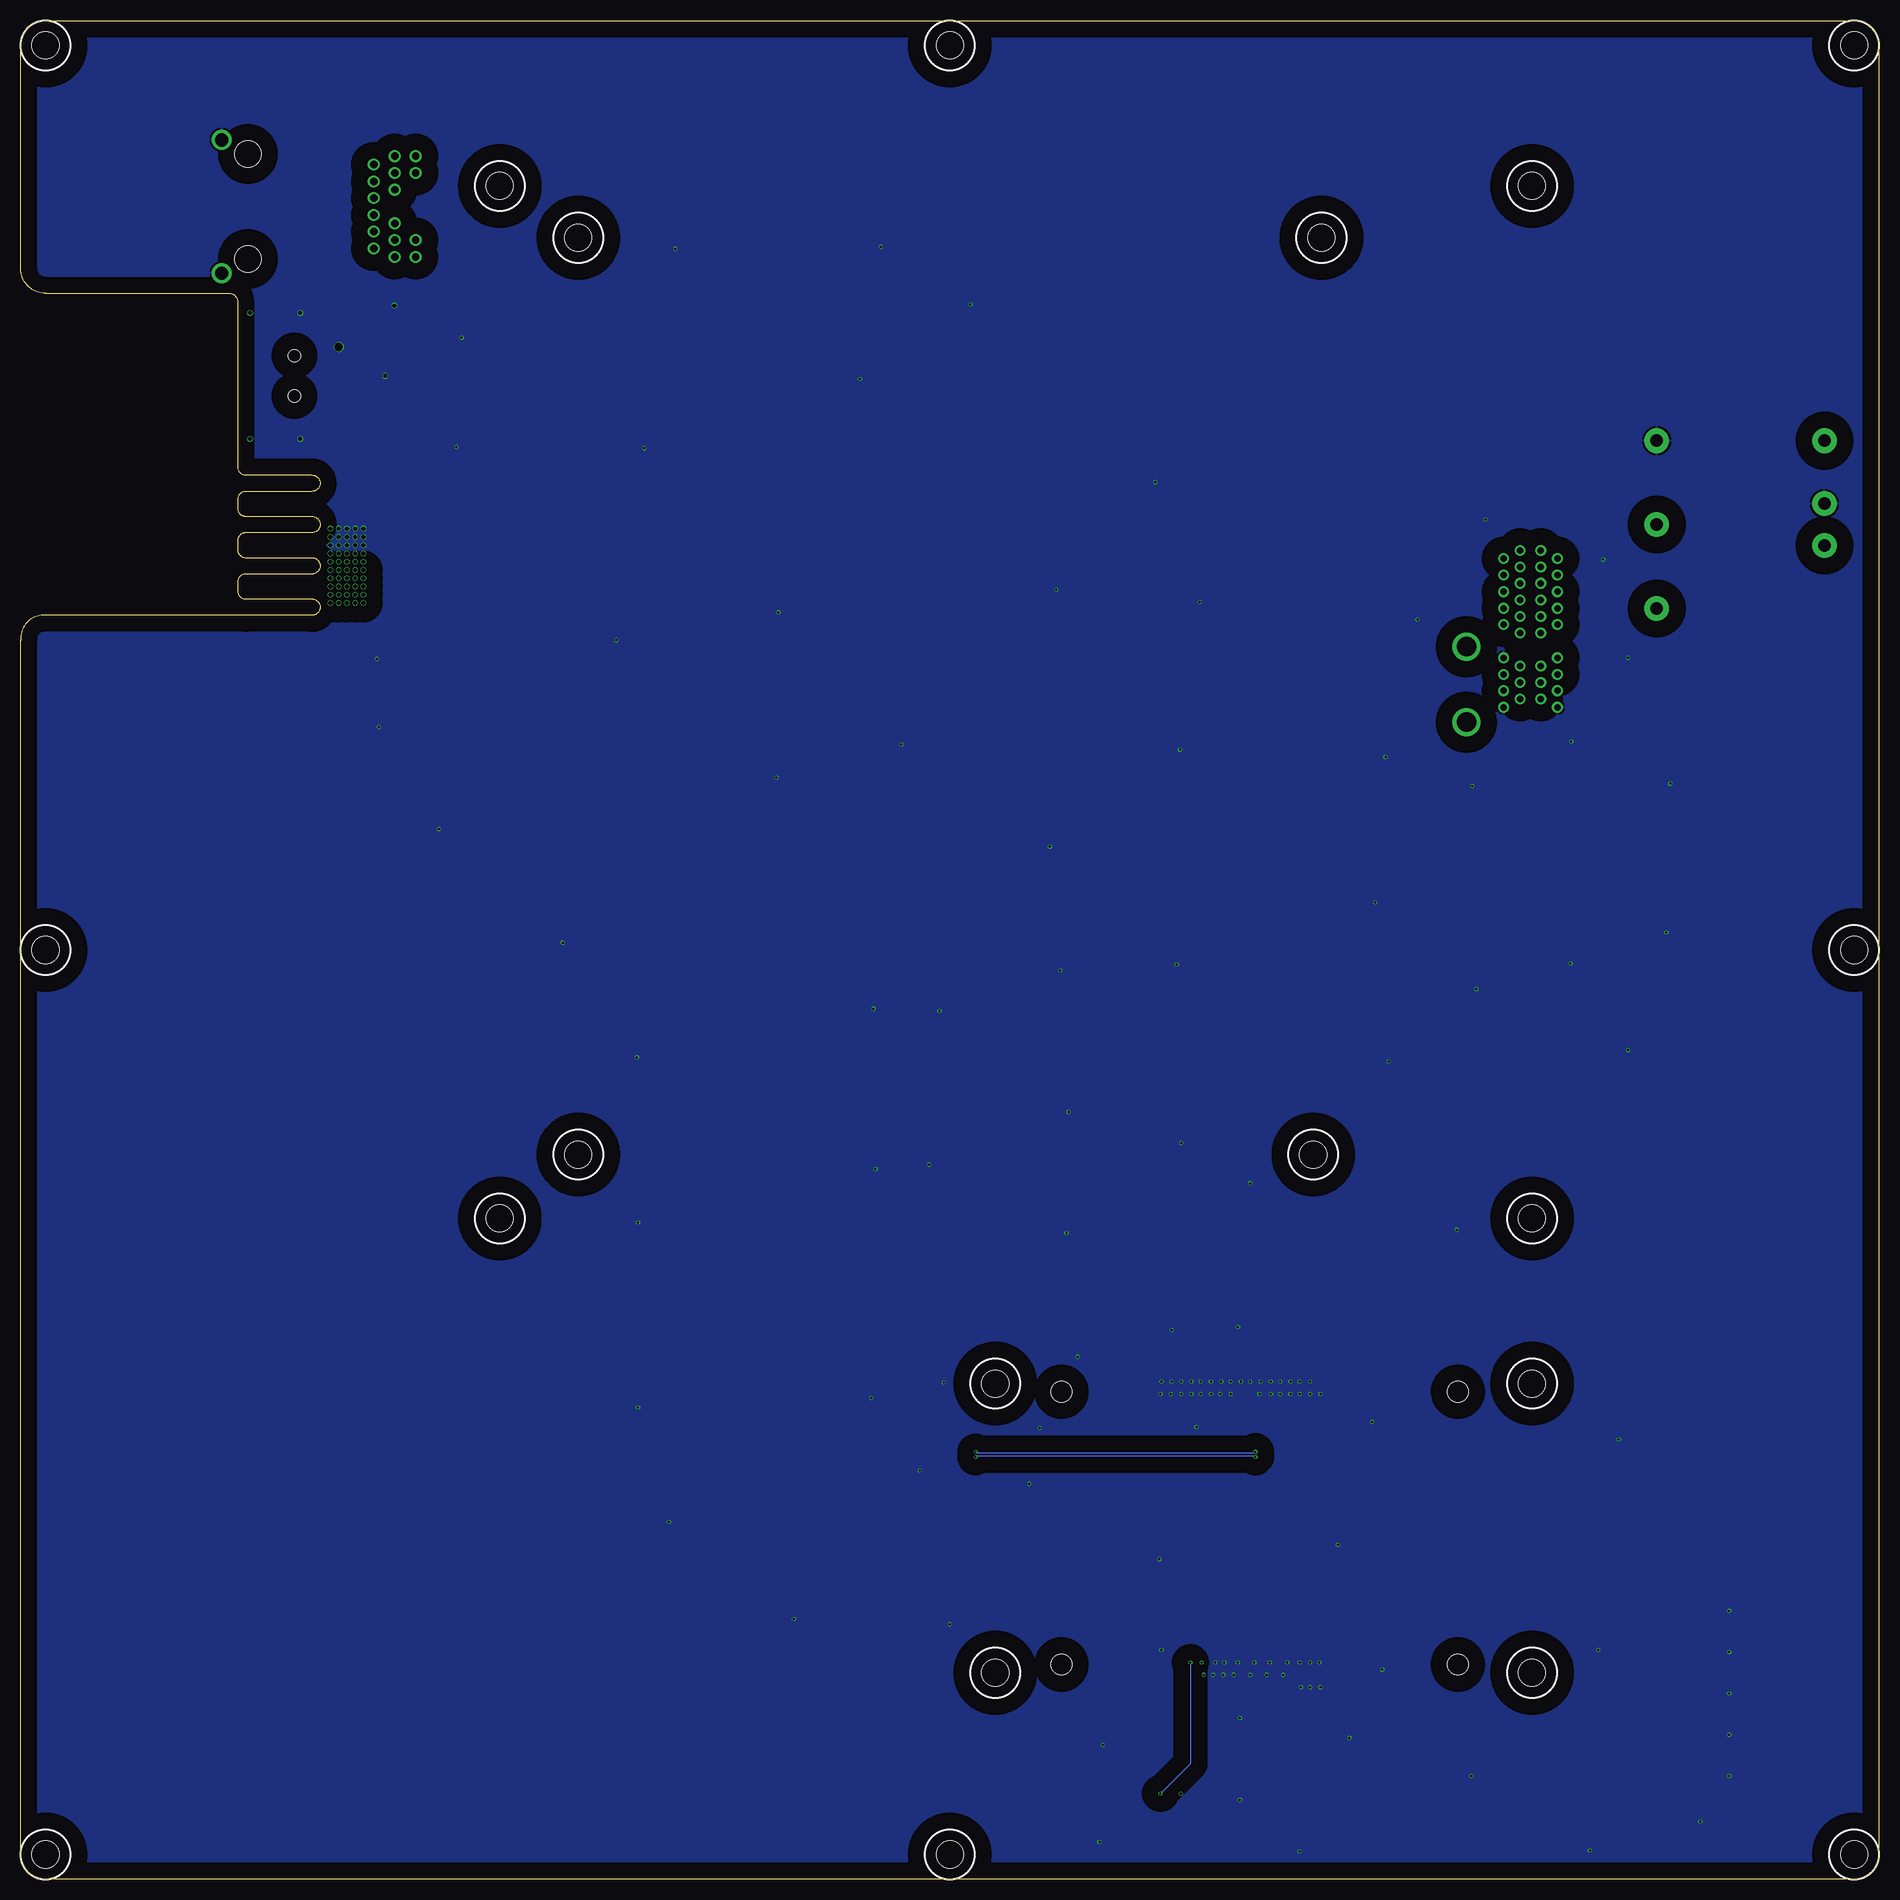
[diagram p5: board, bottom side, seen from below]

Size 225.01 x 225 mm. Coordinates in mm from the lower left corner, seen from the top.
Outline: 197.75,153 222.5,153 arc-90 225,150 225,3 arc-90 222,0 3,0 arc-90 0,3 0,222 arc-90 3,225 222,225 arc-90 225,222 225,195 arc-90 222,192 199.75,192 arc90 198.75,191 198.75,171 arc-90 197.75,170
Copper layers (1*2*3*16): Top 0.035mm / dielectric 1.5mm / GND 0.035mm / dielectric 0.15mm / PWR 0.035mm / dielectric 0.2mm / Bottom 0.035mm
Design rules "myDRC 4 layers 0.15mm": minimum track width 0.15mm, minimum drill 0.25mm, track to track 0.15mm, track to pad 0.15mm, pad to pad 0.15mm, via to via 0.15mm, smd to smd 0mil, copper to edge 0.25mm, drill to drill 0.25mm, minimum pad ring 10mil, minimum via ring 3mil, stop-mask expansion 4mil, vias tented up to drill 1mm, thermal gap 10mil

### Footprints (pad centres in the part's own frame; a part is rotated, then mirrored left to right if it is on the bottom)
1812 = smd 1.2 x 3.5: 1 -2.25,0; 2 2.25,0
CONN36_2-1761465-1_TEC = drill 2.362 pad 2.362: 37 -11.303,-2.184; 38 -2.159,-2.184 | drill 0.787 pad 1.295: A1 9.5,4.318; A2 8.509,2.311; A3 7.493,4.318; A4 6.502,2.311; A5 5.512,4.318; A6 4.496,2.311; A7 3.505,4.318; A8 2.489,2.311; A9 1.499,4.318; A10 0.508,2.311; A11 -0.508,4.318; A12 -3.505,2.311; A13 -4.496,4.318; A14 -5.512,2.311; A15 -6.502,4.318; A16 -7.493,2.311; A17 -8.509,4.318; A18 -9.5,2.311; B1 9.5,6.807; B2 8.509,8.814; B3 7.493,6.807; B4 6.502,8.814; B5 5.512,6.807; B6 4.496,8.814; B7 3.505,6.807; B8 2.489,8.814; B9 1.499,6.807; B10 0.508,8.814; B11 -0.508,6.807; B12 -3.505,8.814; B13 -4.496,6.807; B14 -5.512,8.814; B15 -6.502,6.807; B16 -7.493,8.814; B17 -8.509,6.807; B18 -9.5,8.814
629104190121 = smd 1.25 x 2: 1 -3.5,3.75; 2 -1,3.75; 3 1,3.75; 4 3.5,3.75 | smd 3.5 x 2: SH1 -7.625,1.35; SH2 -7.625,-4.75; SH3 7.625,1.35; SH4 7.625,-4.75 | hole 1.5: -2.45,0.65; 2.45,0.65
0857931020 = drill 0.9: 1 -15.24,5.075; 2 -15.24,3.045; 3 -15.24,1.015; 4 -15.24,-1.015; 5 -15.24,-3.045; 6 -15.24,-5.075; 7 -17.78,6.09; 8 -17.78,4.06; 9 -17.78,2.03; 10 -17.78,-2.03; 11 -17.78,-4.06; 12 -17.78,-6.09; 13 -20.32,6.09; 14 -20.32,4.06; 15 -20.32,-4.06; 16 -20.32,-6.09 | drill 1.6: SH1 3.18,8.065; SH2 3.18,-8.065 | hole 3.2: 0,6.35; 0,-6.35
PCB_TAB_SMALL = smd 2.5 x 5: 1 0,0
0603_POLAR = smd 0.8 x 0.8: A 0.75,0; K -0.75,0
MOUNTHOLE_6X3 = hole 3.3: 0,0
0603 = smd 0.8 x 0.8: 1 -0.75,0; 2 0.75,0
RPI-CM4 = smd 0.2 x 0.7: 1 7.3,18.54; 2 7.3,15.46; 3 6.9,18.54; 4 6.9,15.46; 5 6.5,18.54; 6 6.5,15.46; 7 6.1,18.54; 8 6.1,15.46; 9 5.7,18.54; 10 5.7,15.46; 11 5.3,18.54; 12 5.3,15.46; 13 4.9,18.54; 14 4.9,15.46; 15 4.5,18.54; 16 4.5,15.46; 17 4.1,18.54; 18 4.1,15.46; 19 3.7,18.54; 20 3.7,15.46; 21 3.3,18.54; 22 3.3,15.46; 23 2.9,18.54; 24 2.9,15.46; 25 2.5,18.54; 26 2.5,15.46; 27 2.1,18.54; 28 2.1,15.46; 29 1.7,18.54; 30 1.7,15.46; 31 1.3,18.54; 32 1.3,15.46; 33 0.9,18.54; 34 0.9,15.46; 35 0.5,18.54; 36 0.5,15.46; 37 0.1,18.54; 38 0.1,15.46; 39 -0.3,18.54; 40 -0.3,15.46; 41 -0.7,18.54; 42 -0.7,15.46; 43 -1.1,18.54; 44 -1.1,15.46; 45 -1.5,18.54; 46 -1.5,15.46; 47 -1.9,18.54; 48 -1.9,15.46; 49 -2.3,18.54; 50 -2.3,15.46; 51 -2.7,18.54; 52 -2.7,15.46; 53 -3.1,18.54; 54 -3.1,15.46; 55 -3.5,18.54; 56 -3.5,15.46; 57 -3.9,18.54; 58 -3.9,15.46; 59 -4.3,18.54; 60 -4.3,15.46; 61 -4.7,18.54; 62 -4.7,15.46; 63 -5.1,18.54; 64 -5.1,15.46; 65 -5.5,18.54; 66 -5.5,15.46; 67 -5.9,18.54; 68 -5.9,15.46; 69 -6.3,18.54; 70 -6.3,15.46; 71 -6.7,18.54; 72 -6.7,15.46; 73 -7.1,18.54; 74 -7.1,15.46; 75 -7.5,18.54; 76 -7.5,15.46; 77 -7.9,18.54; 78 -7.9,15.46; 79 -8.3,18.54; 80 -8.3,15.46; 81 -8.7,18.54; 82 -8.7,15.46; 83 -9.1,18.54; 84 -9.1,15.46; 85 -9.5,18.54; 86 -9.5,15.46; 87 -9.9,18.54; 88 -9.9,15.46; 89 -10.3,18.54; 90 -10.3,15.46; 91 -10.7,18.54; 92 -10.7,15.46; 93 -11.1,18.54; 94 -11.1,15.46; 95 -11.5,18.54; 96 -11.5,15.46; 97 -11.9,18.54; 98 -11.9,15.46; 99 -12.3,18.54; 100 -12.3,15.46; 101 7.3,-15.46; 102 7.3,-18.54; 103 6.9,-15.46; 104 6.9,-18.54; 105 6.5,-15.46; 106 6.5,-18.54; 107 6.1,-15.46; 108 6.1,-18.54; 109 5.7,-15.46; 110 5.7,-18.54; 111 5.3,-15.46; 112 5.3,-18.54; 113 4.9,-15.46; 114 4.9,-18.54; 115 4.5,-15.46; 116 4.5,-18.54; 117 4.1,-15.46; 118 4.1,-18.54; 119 3.7,-15.46; 120 3.7,-18.54; 121 3.3,-15.46; 122 3.3,-18.54; 123 2.9,-15.46; 124 2.9,-18.54; 125 2.5,-15.46; 126 2.5,-18.54; 127 2.1,-15.46; 128 2.1,-18.54; 129 1.7,-15.46; 130 1.7,-18.54; 131 1.3,-15.46; 132 1.3,-18.54; 133 0.9,-15.46; 134 0.9,-18.54; 135 0.5,-15.46; 136 0.5,-18.54; 137 0.1,-15.46; 138 0.1,-18.54; 139 -0.3,-15.46; 140 -0.3,-18.54; 141 -0.7,-15.46; 142 -0.7,-18.54; 143 -1.1,-15.46; 144 -1.1,-18.54; 145 -1.5,-15.46; 146 -1.5,-18.54; 147 -1.9,-15.46; 148 -1.9,-18.54; 149 -2.3,-15.46; 150 -2.3,-18.54; 151 -2.7,-15.46; 152 -2.7,-18.54; 153 -3.1,-15.46; 154 -3.1,-18.54; 155 -3.5,-15.46; 156 -3.5,-18.54; 157 -3.9,-15.46; 158 -3.9,-18.54; 159 -4.3,-15.46; 160 -4.3,-18.54; 161 -4.7,-15.46; 162 -4.7,-18.54; 163 -5.1,-15.46; 164 -5.1,-18.54; 165 -5.5,-15.46; 166 -5.5,-18.54; 167 -5.9,-15.46; 168 -5.9,-18.54; 169 -6.3,-15.46; 170 -6.3,-18.54; 171 -6.7,-15.46; 172 -6.7,-18.54; 173 -7.1,-15.46; 174 -7.1,-18.54; 175 -7.5,-15.46; 176 -7.5,-18.54; 177 -7.9,-15.46; 178 -7.9,-18.54; 179 -8.3,-15.46; 180 -8.3,-18.54; 181 -8.7,-15.46; 182 -8.7,-18.54; 183 -9.1,-15.46; 184 -9.1,-18.54; 185 -9.5,-15.46; 186 -9.5,-18.54; 187 -9.9,-15.46; 188 -9.9,-18.54; 189 -10.3,-15.46; 190 -10.3,-18.54; 191 -10.7,-15.46; 192 -10.7,-18.54; 193 -11.1,-15.46; 194 -11.1,-18.54; 195 -11.5,-15.46; 196 -11.5,-18.54; 197 -11.9,-15.46; 198 -11.9,-18.54; 199 -12.3,-15.46; 200 -12.3,-18.54 | hole 2.55: -24,-16.5; -24,16.5; 24,16.5; 24,-16.5
PDQE10 = drill 1.5 pad 3: 1 2.54,10.16; 2 -2.54,10.16; 3 -10.16,-10.16; 4 0,-10.16; 5 10.16,-10.16; 6 10.16,10.16
SOT23-6 = smd 0.6 x 1.1: 1 0.95,1.35; 2 0,1.35; 3 -0.95,1.35; 4 -0.95,-1.35; 5 0,-1.35; 6 0.95,-1.35

### Placement (x,y rotation side)
C1  179.75,190.62 90 top
CN1  47.75,151.38 90 top
CN2  192.5,182 90 top
CN3  197.5,202.5 0 top
CN4  193.75,156.5 270 top
CN5  193.75,161.5 270 top
CN6  193.75,166.5 270 top
D1  20,12.5 0 top
D2  20,17.5 0 top
D3  20,22.5 0 top
D4  20,27.5 0 top
D5  20,32.5 0 top
MECH1  3,222 0 top
MECH2  112.5,222 0 top
MECH3  222,222 0 top
MECH4  3,112.5 0 top
MECH5  6mm x 3mm  [MOUNTHOLE_6X3]  42,80 270 top
MECH6  222,112.5 0 top
MECH7  3,3 0 top
MECH8  112.5,3 0 top
MECH9  222,3 0 top
MECH10  6mm x 3mm  [MOUNTHOLE_6X3]  157.5,198.72 270 top
MECH11  6mm x 3mm  [MOUNTHOLE_6X3]  67.5,198.72 270 top
MECH12  6mm x 3mm  [MOUNTHOLE_6X3]  68.5,87.72 270 top
MECH13  6mm x 3mm  [MOUNTHOLE_6X3]  157.5,87.72 270 top
MECH14  6mm x 3mm  [MOUNTHOLE_6X3]  167,80 270 top
MECH15  6mm x 3mm  [MOUNTHOLE_6X3]  167,205 270 top
MECH16  6mm x 3mm  [MOUNTHOLE_6X3]  42,205 270 top
MECH17  6mm x 3mm  [MOUNTHOLE_6X3]  42,60 270 top
MECH18  6mm x 3mm  [MOUNTHOLE_6X3]  42,25 270 top
MECH19  6mm x 3mm  [MOUNTHOLE_6X3]  107,25 270 top
MECH20  6mm x 3mm  [MOUNTHOLE_6X3]  107,60 270 top
R1  88.25,12.12 90 top
R2  72.75,12.12 90 top
R3  71.5,12.12 90 top
R4  70.25,12.12 90 top
R5  69,12.12 90 top
R6  87,12.12 90 top
R7  85.75,12.12 90 top
R8  84.5,12.12 90 top
RPI-CM1  75,42.5 180 top
U1  16.75,164 90 top
U2  183.5,182 90 top

### Tracks (layer width: path | path; a pad name or v marks a point on that pad's centre or on a via)
3V3
  Top 1: U1.3 38.91,153.84 CN1.B8 38.94,152.88 | 38.94,152.88 CN1.B10 | 38.94,152.88 38.94,152.87 CN1.B9 CN1.A9 45.44,152.88 | CN1.A10 45.44,152.88 | 45.44,152.88 CN1.A8 CN1.A6 44.94,155.87 43.92,156.89 CN1.A5
5V
  Top 0.15: RPI-CM1.77 82.9,24.97 82.88,25 | RPI-CM1.79 83.3,24.92 83.38,25 83.7,24.67 RPI-CM1.81 | RPI-CM1.83 84.1,24.97 84.12,25 84.5,24.62 RPI-CM1.85 | RPI-CM1.87 84.9,24.81 85.09,25
  Top 0.5: U2.5 183.5,182
  Top 1: 183.5,182 183.5,178.5 | 183.5,178.5 183.5,166.75 183.75,166.5 | CN2.1 183.5,178.5 | 85.62,25.54 85.09,25 84.12,25 83.38,25 82.88,25
  Top 10: 172.62,162.5 170,159.88 170,140.62 | 170,139 141,110 141,60.25 120.5,39.75 106.12,39.75 103.12,39.75 92.62,29.25
  Top 2: CN6.1 183.75,166.5 182.25,166.5 | 178.62,166.5 172.5,166.5 171.88,165.88 176,165.88 176,162.5 172.62,162.5 | 170,140.62 170,139 | 174.25,159.75 175.5,159.75 182.25,166.5 | 106.12,39.75 104.38,39.75 90.16,25.54 85.62,25.54 | 182.25,166.5 180.75,166.5 | 178.62,166.5 180.75,166.5 | 178.62,166.5 174.12,162 176.25,162 180.75,166.5
12V  (via drill 0.5)
  other vias: 187.5,158.5 187.5,157.5 187.5,156.5 187.5,155.5 187.5,154.5 186.5,154.5 186.5,155.5 186.5,156.5 186.5,157.5 186.5,158.5 185.5,158.5 185.5,157.5 185.5,156.5 185.5,155.5 185.5,154.5 184.5,154.5 184.5,155.5 184.5,156.5 184.5,157.5 184.5,158.5 183.5,158.5 183.5,157.5 183.5,156.5 183.5,155.5 183.5,154.5
  pour PWR: 3,0 222,0 arc90 225,3 225,222 arc90 222,225 3,225 arc90 0,222 0,3 arc90
  pour Top (no thermals): 183.12,158.88 188,158.88 188.88,158 198.75,158 198.75,155 188.88,155 188,154.12 183.12,154.12
CM4_ETH_LED1
  Top 0.15: RPI-CM1.19 71.3,16.33 71.5,16.12 R3.2
CM4_ETH_LED2
  Top 0.15: RPI-CM1.17 70.9,16.4 70.25,15.75 R4.2
CM4_ETH_LED3
  Top 0.15: RPI-CM1.15 70.5,16.5 69,15 R5.2
CM4_ETH_TRD0_N
  Top 0.15: RPI-CM1.10 69.3,28.8 95,54.5 95,159.12 121.75,185.88 162.62,185.88 176.62,199.88 179.12,199.88 CN3.10
CM4_ETH_TRD0_P
  Top 0.15: CN3.11 179.72,198.53 178.75,199.5 176.75,199.5 162.75,185.5 122,185.5 95.38,158.88 95.38,54.38 69.7,28.7 RPI-CM1.12
CM4_ETH_TRD1_N
  Top 0.15: CN3.5 182.26,199.99 180.75,201.5 176.75,201.5 162.25,187 121,187 93.88,159.88 93.88,55 68.5,29.62 RPI-CM1.6
CM4_ETH_TRD1_P
  Top 0.15: CN3.4 181.26,201.49 180.87,201.88 176.62,201.88 162.12,187.38 120.88,187.38 93.5,160 93.5,55.12 68.1,29.72 RPI-CM1.4
CM4_ETH_TRD2_N
  Top 0.15: CN3.2 182.26,205.38 180,203.12 175.38,203.12 161.38,189.12 120,189.12 91.75,160.88 91.75,55.75 66.5,30.5 66.5,26.25 67.38,25.38 68.88,25.38 69.3,24.95 RPI-CM1.9
CM4_ETH_TRD2_P
  Top 0.15: CN3.3 180.89,203.51 180.12,202.75 175.5,202.75 161.5,188.75 120.12,188.75 92.12,160.75 92.12,55.62 66.88,30.38 66.88,26.38 67.5,25.75 69,25.75 69.7,25.05 RPI-CM1.11
CM4_ETH_TRD3_N
  Top 0.15: CN3.9 179.12,205.12 175,205.12 160.75,190.88 120.19,190.88 90.25,160.93 90.25,56.5 65.75,32 65.75,25.88 66.62,25 68.12,25 68.5,24.62 RPI-CM1.5
CM4_ETH_TRD3_P
  Top 0.15: CN3.8 178.66,205.5 174.88,205.5 160.62,191.25 120.04,191.25 89.88,161.09 89.88,56.62 65.38,32.12 65.38,25.75 66.5,24.62 68,24.62 68.1,24.53 RPI-CM1.3
CM4_PCIE_CLK_N
  Top 0.15: RPI-CM1.112 69.7,61.83 69.75,61.88 69.75,68.62 42.38,96 42.38,145.38 42.88,145.88 45.43,145.88 CN1.A14
CM4_PCIE_CLK_P
  Top 0.15: RPI-CM1.110 69.3,61.8 69.38,61.88 69.38,68.5 42,95.88 42,145.5 42.25,145.75 42.25,145.88 41.88,146.25 41.88,146.38 42,146.5 42.12,146.5 42.5,146.12 42.62,146.12 CN1.A13
CM4_PCIE_CLK_REQ
  Top 0.15: CN1.B12 37,147.87 32.25,143.12 32.25,100.62 60.75,72.12 60.75,66.5 66.21,61.04 RPI-CM1.102
CM4_PCIE_PCIE_RST
  Top 0.15: RPI-CM1.109 69.3,58.42 69.5,58.62 69.5,59.12 69.12,59.5 67.12,59.5 60.38,66.25 60.38,72 31.88,100.5 31.88,143.25 40.5,151.88 42.42,151.88 CN1.A11
CM4_PCIE_RX_N
  Top 0.15: RPI-CM1.118 70.9,61.73 70.88,61.75 70.88,71.25 44.5,97.62 44.5,142.32 45.44,143.26 CN1.A16
CM4_PCIE_RX_P
  Top 0.15: RPI-CM1.116 70.5,71.12 44.12,97.5 44.12,142.38 44.38,142.62 44.38,143 44.19,143.19 43.75,143.19 CN1.A17
CM4_PCIE_TX_N
  Top 0.15: RPI-CM1.124 72.1,61.85 72.12,61.88 72.12,73.75 53.5,92.38 53.5,141.78 45.91,149.38 41.09,149.38 39.81,148.09 39.81,147.51 39.62,147.32 39.62,146.55 CN1.B14
CM4_PCIE_TX_P
  Top 0.15: RPI-CM1.122 71.75,61.09 71.75,73.62 53.12,92.25 53.12,141.62 45.75,149 41.25,149 40.11,147.86 40.11,147.38 40,147.28 40,145.81 CN1.B15
CM4_PI_ACT
  Top 0.15: RPI-CM1.21 71.7,16.42 72.75,15.38 R2.2
CM4_PI_POWERED
  Top 0.15: RPI-CM1.95 86.5,16.38 88.25,14.62 R1.2
CM4_PWR_1V8
  Top 0.15: RPI-CM1.90 RPI-CM1.88
CM4_PWR_3V3  (via drill 0.3)
  Top 0.15: RPI-CM1.78 82.9,26.47 83.12,26.25 v83.38,26.25 84.12,26.25 | RPI-CM1.86 84.5,26.38 84.38,26.25 84.12,26.25 | RPI-CM1.84 84.12,27.02 84.12,26.25 | R6.1 v87,10.38
  Bottom 0.15: v83.38,26.25 83.38,14 v87,10.38
CM4_USB_N  (via drill 0.25, 0.3)
  Top 0.15: U2.3 180.2,181.05 179.5,181.75 169.75,181.75 118,130 118,58.12 111.12,51.25 109.5,51.25 v109.38,51.12 | RPI-CM1.103 68.1,54.52 71.38,51.25 75.38,51.25 v75.5,51.12
  Bottom 0.15: v109.38,51.12 109.25,51.25 75.62,51.25 v75.5,51.12
CM4_USB_P  (via drill 0.25, 0.3)
  Top 0.15: U2.1 180.32,182.95 179.5,182.12 169.59,182.12 117.62,130.16 117.62,58.25 111,51.62 109.5,51.62 v109.38,51.75 | RPI-CM1.105 68.5,54.62 71.5,51.62 75.38,51.62 v75.5,51.75
  Bottom 0.15: v75.5,51.75 75.62,51.62 109.25,51.62 v109.38,51.75
GND  (via drill 0.3, 0.35, 0.5, 1)
  Top 0.15: RPI-CM1.101 67.7,58.67 v67.62,58.75 | RPI-CM1.107 68.9,58.73 v68.88,58.75 | RPI-CM1.108 68.9,60.27 v68.88,60.25 | RPI-CM1.114 70.1,60.27 v70.12,60.25 | RPI-CM1.113 70.1,58.73 v70.12,58.75 | RPI-CM1.119 71.3,58.7 v71.25,58.75 | RPI-CM1.120 71.3,60.3 v71.25,60.25 | RPI-CM1.126 v72.5,60.25 | RPI-CM1.125 v72.5,58.75 | RPI-CM1.131 73.7,58.67 v73.62,58.75 | RPI-CM1.132 73.7,60.33 v73.62,60.25 | RPI-CM1.138 74.9,60.27 v74.88,60.25 | RPI-CM1.137 74.9,58.65 v75,58.75 | RPI-CM1.144 76.1,60.27 v76.12,60.25 | RPI-CM1.150 77.3,60.3 v77.25,60.25 | RPI-CM1.156 v78.5,60.25 | RPI-CM1.155 v78.5,58.75 | RPI-CM1.161 79.7,58.7 v79.75,58.75 | RPI-CM1.162 79.7,60.33 v79.62,60.25 | RPI-CM1.168 80.9,60.27 v80.88,60.25 | RPI-CM1.167 80.9,58.73 v80.88,58.75 | RPI-CM1.174 82.1,60.27 v82.12,60.25 | RPI-CM1.173 82.1,58.73 v82.12,58.75 | RPI-CM1.179 83.3,58.7 v83.25,58.75 | RPI-CM1.180 83.3,60.3 v83.25,60.25 | RPI-CM1.186 v84.5,60.25 | RPI-CM1.192 85.7,60.33 v85.62,60.25 | RPI-CM1.198 86.9,60.27 v86.88,60.25 | RPI-CM1.185 v84.5,58.75 | RPI-CM1.191 85.7,58.7 v85.75,58.75 | RPI-CM1.197 86.9,58.65 v87,58.75 | RPI-CM1.2 67.7,26.3 v67.75,26.25 | RPI-CM1.8 68.9,26.28 v68.88,26.25 | RPI-CM1.14 70.1,26.28 v70.12,26.25 | RPI-CM1.22 71.7,26.33 v71.62,26.25 | RPI-CM1.32 73.7,26.3 v73.75,26.25 | RPI-CM1.42 75.7,26.33 v75.62,26.25 | RPI-CM1.52 77.7,26.33 v77.62,26.25 | RPI-CM1.60 79.3,26.3 v79.25,26.25 | RPI-CM1.66 80.5,26.38 v80.38,26.25 | RPI-CM1.74 82.1,26.35 v82,26.25 | RPI-CM1.98 86.9,27.72 v86.88,27.75 | RPI-CM1.1 67.7,23.33 v67.62,23.25 | RPI-CM1.7 68.9,23.28 v68.88,23.25 | RPI-CM1.13 70.1,23.35 v70,23.25 | RPI-CM1.23 72.1,24.72 v72.12,24.75 | RPI-CM1.33 74.1,24.72 v74.12,24.75
  Top 0.15: RPI-CM1.43 76.1,24.72 v76.12,24.75 | RPI-CM1.53 78.1,24.72 v78.12,24.75 | RPI-CM1.59 79.3,24.67 v79.38,24.75 | RPI-CM1.65 80.5,24.62 v80.62,24.75 | RPI-CM1.71 81.7,24.7 v81.75,24.75 | D5.K v18.12,32.5 | D4.K v18.12,27.5 | D3.K v18.12,22.5 | D2.K v18.12,17.5 | D1.K v18.12,12.5 | R7.1 R8.1 v84.5,10.38
  Top 0.5: C1.1 v179.75,190.5 | U2.2 v180.88,182
  Top 1: CN2.4 v186.5,185.5
  other vias: 191.15,189.62 197.25,189.62 197.25,174.38 191.15,174.38 187.5,163.5 187.5,162.5 187.5,161.5 187.5,160.5 187.5,159.5 186.5,163.5 186.5,162.5 186.5,161.5 186.5,160.5 186.5,159.5 185.5,163.5 185.5,162.5 185.5,161.5 185.5,160.5 185.5,159.5 184.5,163.5 184.5,162.5 184.5,161.5 184.5,160.5 184.5,159.5 183.5,163.5 183.5,162.5 183.5,161.5 183.5,160.5 183.5,159.5 172.25,173.38 152.88,150 133.5,133.38 113.75,105.12 115,86.5 122,58.25 87.12,38.75 49.25,132.38 48.75,107.75 37.25,137.75 37.38,110.88 77.38,19.5 77.38,9.62 100.38,125 99.62,156.12 149.5,173.25 123.38,181.62 145.75,197.38 120.88,197.62 110,190.62 87.62,169.12 82.25,154.62 84.62,136.75 85,110.75 84.5,89.12 85.62,66.5 77.62,66.88 76.12,84.25 59.38,99 61,118.25 59.75,135.88 55.88,152.5 47.62,164.62 33.38,159.75 30.38,147.88 25.25,132.62 25.75,114.62 30.38,100.38 51.12,78.62 61.38,55.38 82.62,54.75 65.5,40.5 60.12,25.38 64.12,17.12 49.38,12.5 34,27.75 21.62,7 31.5,53.25 35,3.5 70.12,3.38 94.38,4.5 94,16.25 112.5,30.88 131.38,31.5 146.5,43.25 150.25,57.12 150.25,79.5 150.38,99.5 159.38,113.38 174.38,127.12 181.62,139.5 181.88,147.75 99.12,110 97,63.25 98.38,78.25 98.12,92.88 113.25,60.12 101.62,54.62 102.88,47.88 116.12,49.5 121.5,86 121.75,105.38 118.38,137.38 133.25,153.38 171.62,186.62
  pour GND: 3,0 222,0 arc90 225,3 225,222 arc90 222,225 3,225 arc90 0,222 0,3 arc90
  pour Top (rank 2, no thermals): 183.12,163.88 188,163.88 188.88,163 198.75,163 198.75,160 188.88,160 188,159.12 183.12,159.12
  pour Bottom (isolate 2): 3,0 222,0 arc90 225,3 225,222 arc90 222,225 3,225 arc90 0,222 0,3 arc90
  pour Top (isolate 2, rank 6): 3,0 222,0 arc90 225,3 225,222 arc90 222,225 3,225 arc90 0,222 0,3 arc90
N$1
  Top 0.15: R1.1 88.25,8.38 86.38,6.5 29.62,6.5 23.62,12.5 D1.A
N$2
  Top 0.15: U2.4 188.7,181.05 CN2.2
N$3
  Top 0.15: R2.1 68.25,6.88 29.75,6.88 27.38,9.25 27.38,13.38 23.25,17.5 D2.A
N$4
  Top 0.15: U2.6 188.7,182.95 CN2.3
N$5
  Top 0.15: R3.1 71.5,10.62 68.12,7.25 29.88,7.25 27.75,9.38 27.75,18.12 23.38,22.5 D3.A
N$6
  Top 0.5: C1.2 179.75,196.38 CN3.12 181.25,196.41 CN3.6 183.88,199.04 183.88,205.96 CN3.1 181.25,208.59 CN3.7
N$7
  Top 0.15: R4.1 70.25,9.88 68,7.62 30,7.62 28.12,9.5 28.12,22.88 23.5,27.5 D4.A
N$8
  Top 0.15: RPI-CM1.93 86.1,16.28 87,15.38 R6.2
N$9
  Top 0.15: R5.1 69,9.12 67.88,8 30.12,8 28.5,9.62 28.5,28.25 24.25,32.5 D5.A
N$10
  Top 0.15: RPI-CM1.91 85.7,12.92 R7.2
N$11
  Top 0.15: RPI-CM1.89 85.3,16.3 84.5,15.5 R8.2

### Text on the board
Top: GSWDH | dsp_main rev 1.0.0
tPlace: POWER | ACT | ETH1 | ETH2 | ETH3
tStop: GSWDH | dsp_main rev 1.0.0